# EasyEDA Pro project USB Hub Switch.eprj

# Schematic Schematic 3.0.0

## Sheets
1 Upstream Ports: Board Name: USB Hub Switch V3.0.0; Create Date: 2026-01-22; Page Name: Upstream Ports; Project Name: USB Hub Switch; Schematic Name: Schematic 3.0.0; Update Date: 2026-01-22; Company: EasyEDA.com; Page Size: A4; Version: V1.0
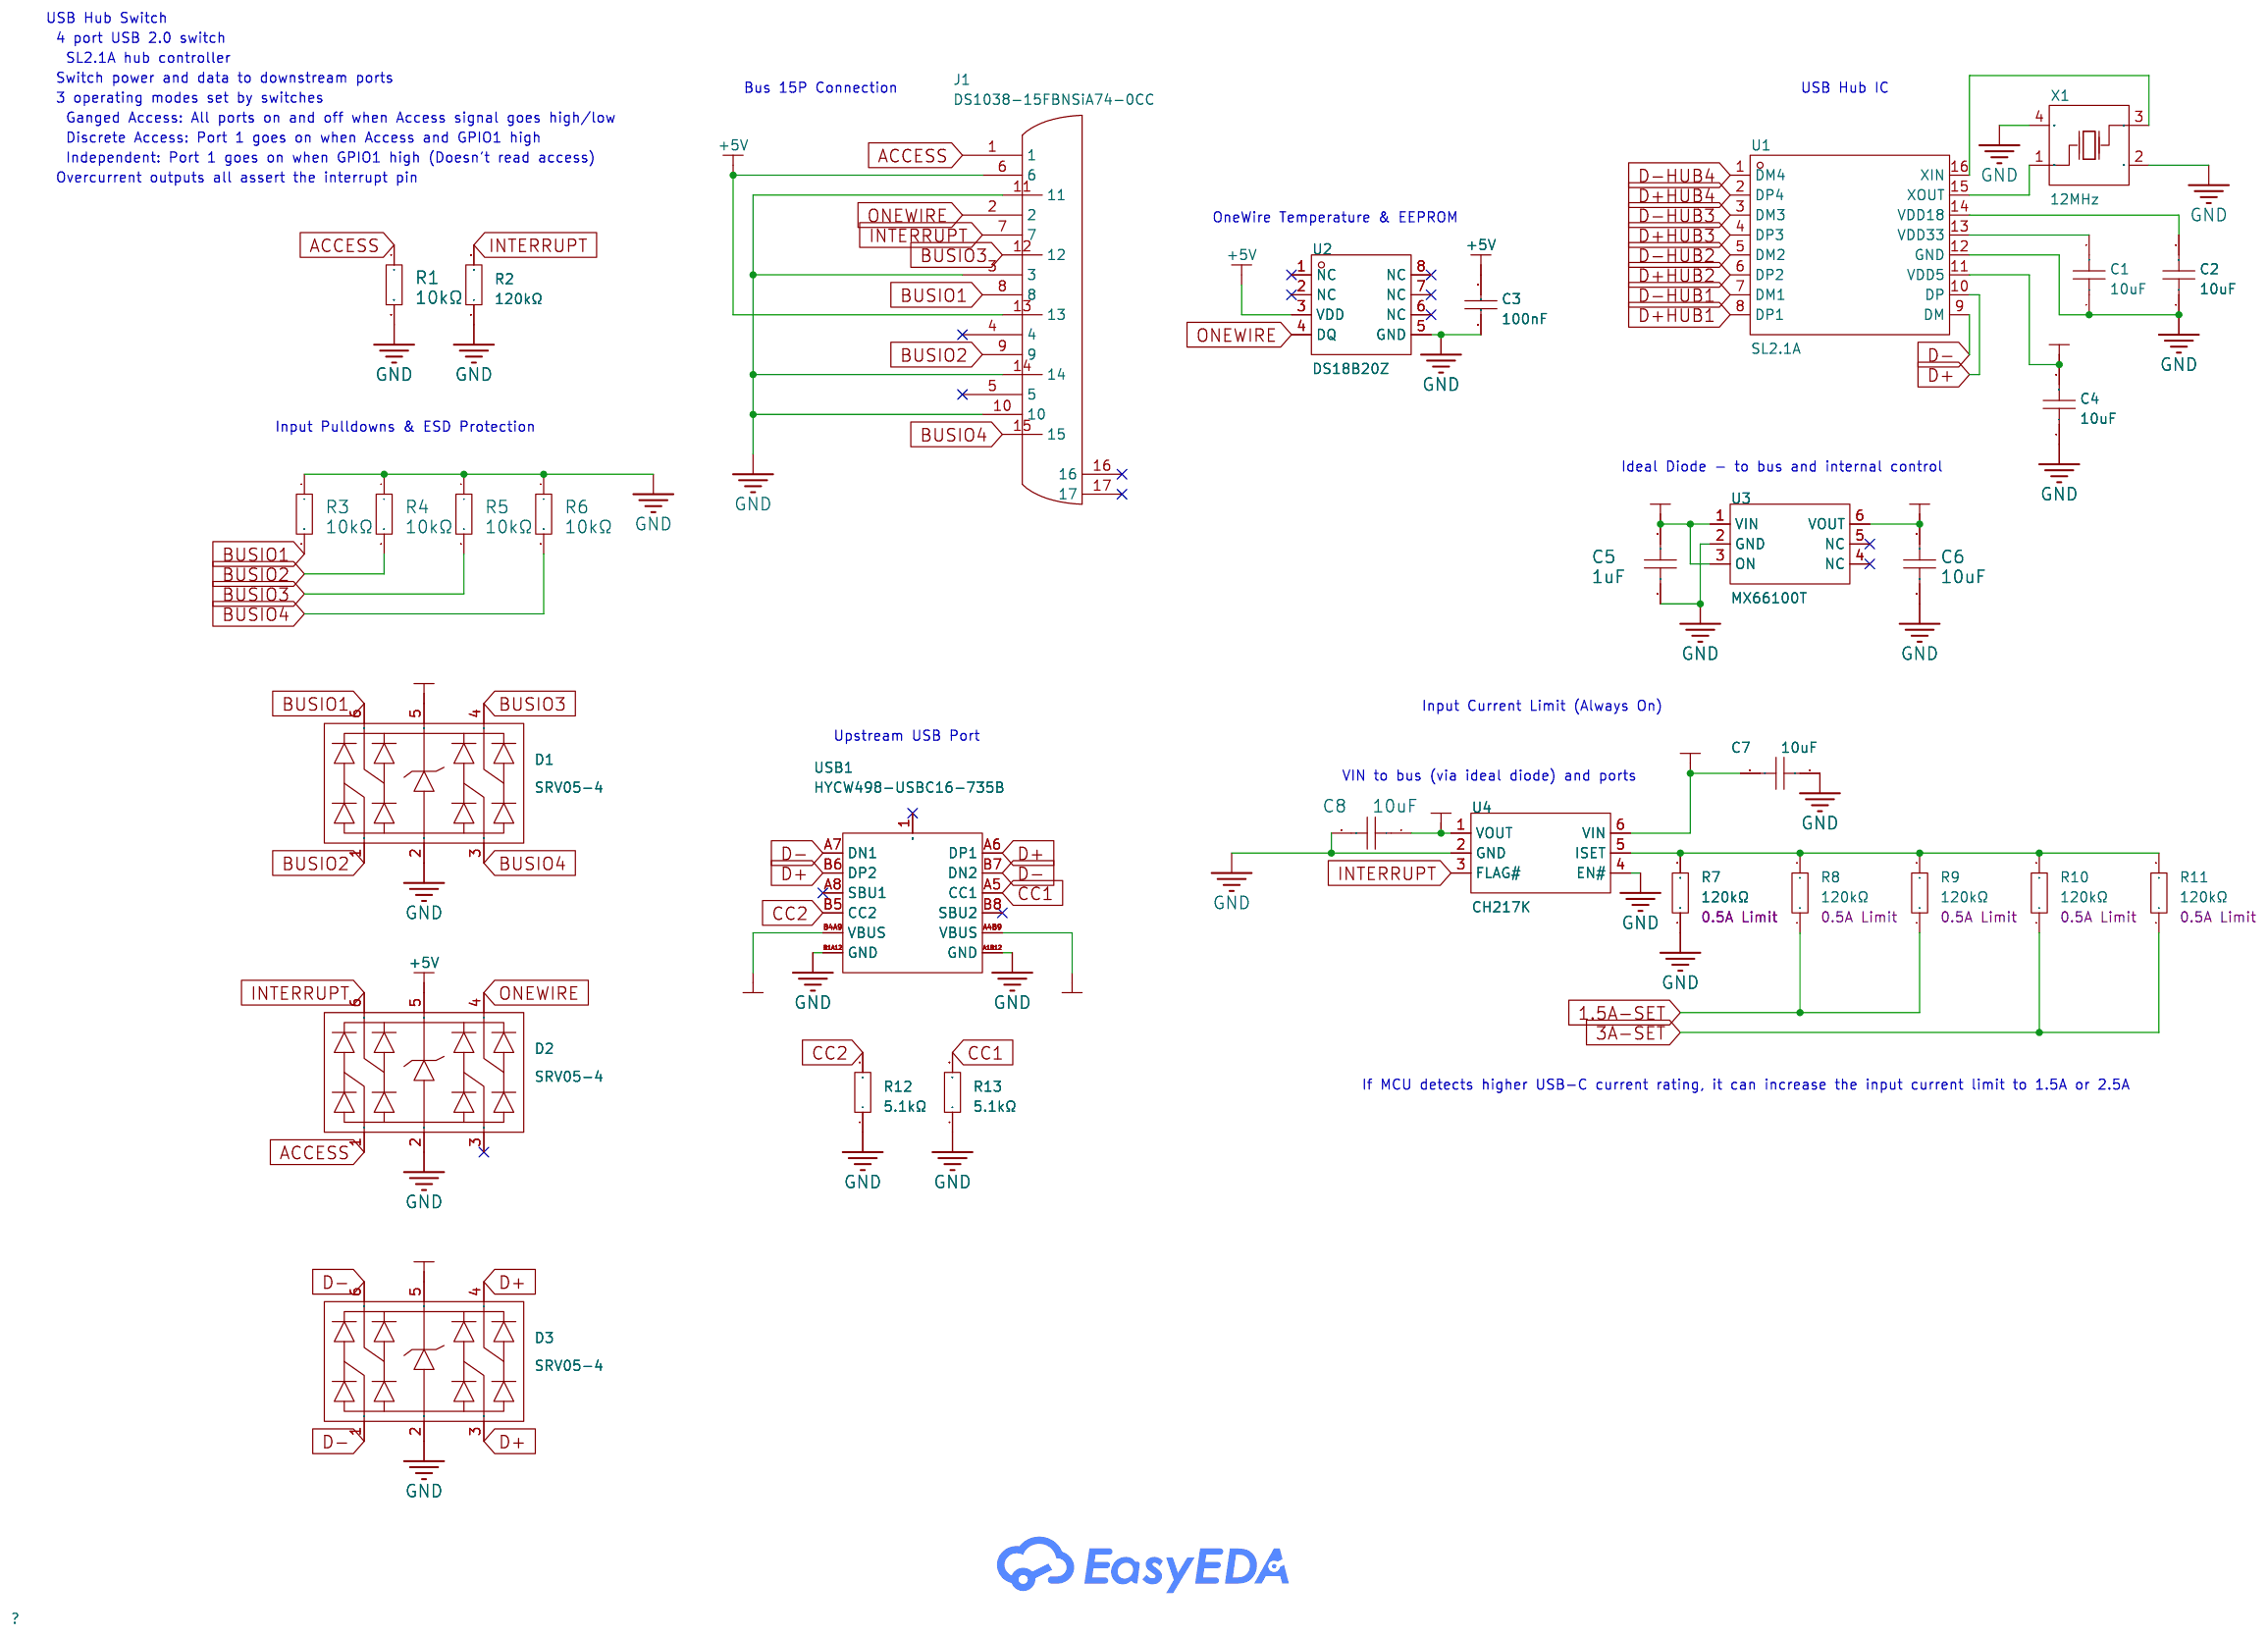
[diagram p0: Upstream Ports]
2 Downstream Ports: Page Name: Downstream Ports
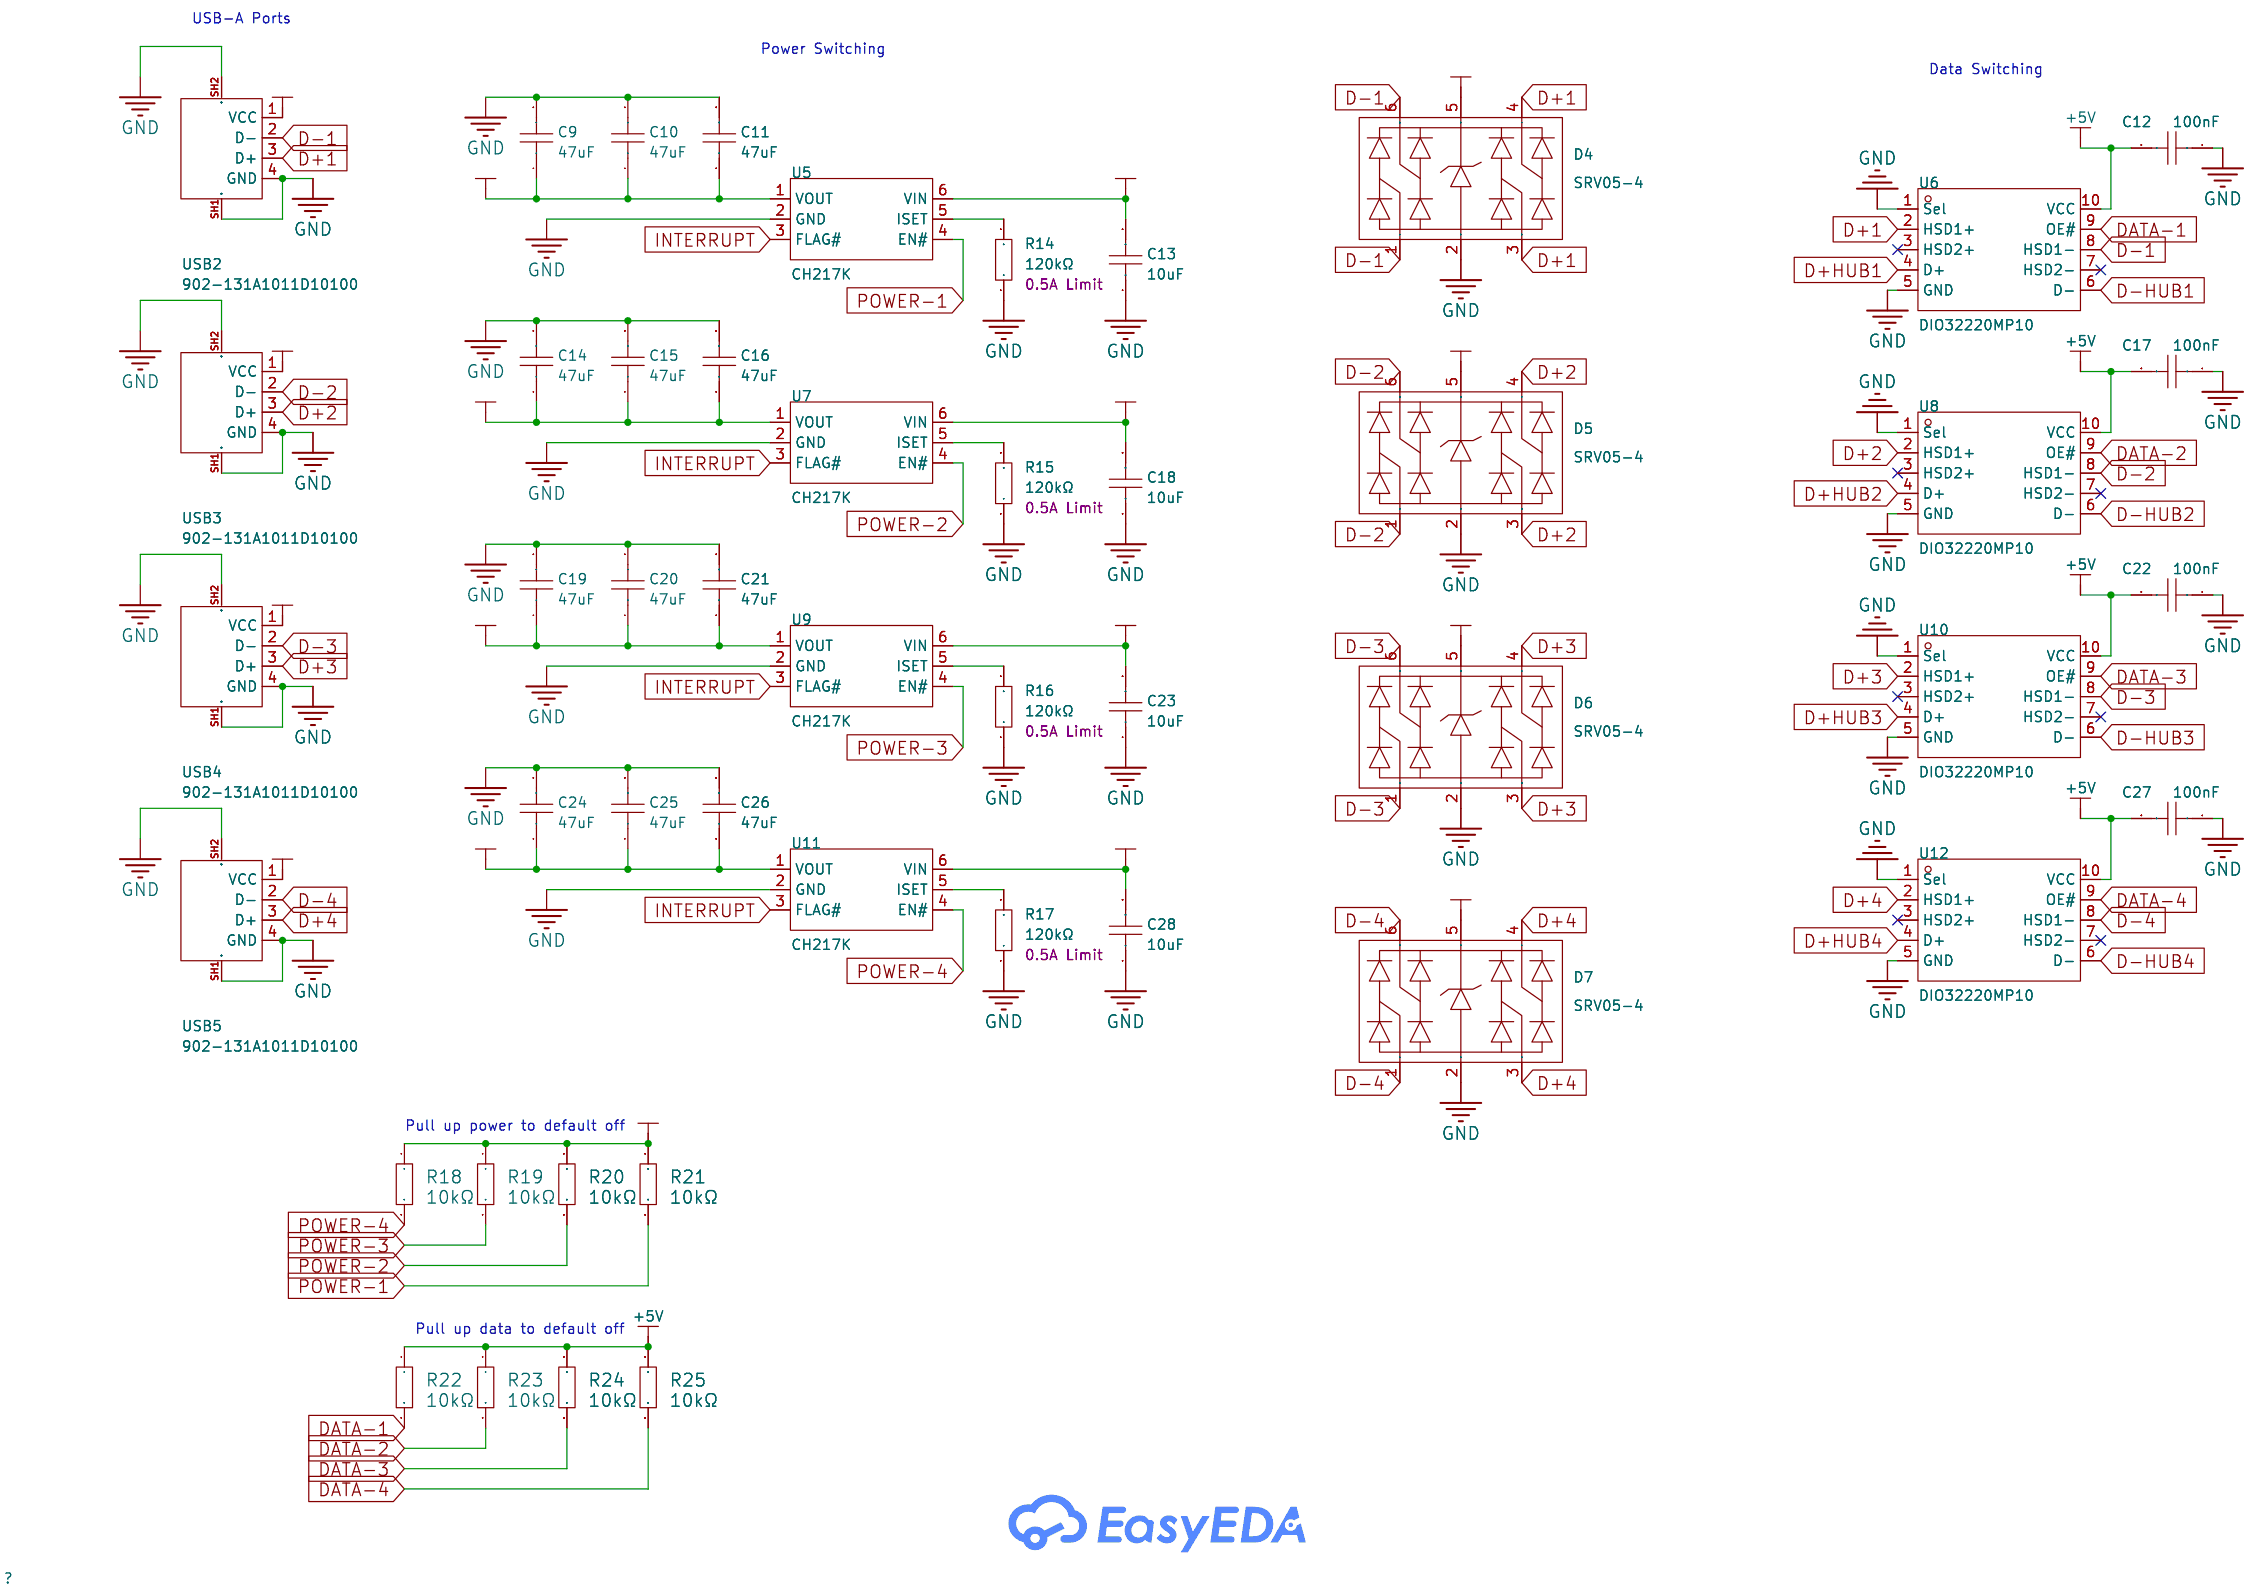
[diagram p1: Downstream Ports]
3 Microcontroller: Page Name: Microcontroller; Update Date: 2026-01-23
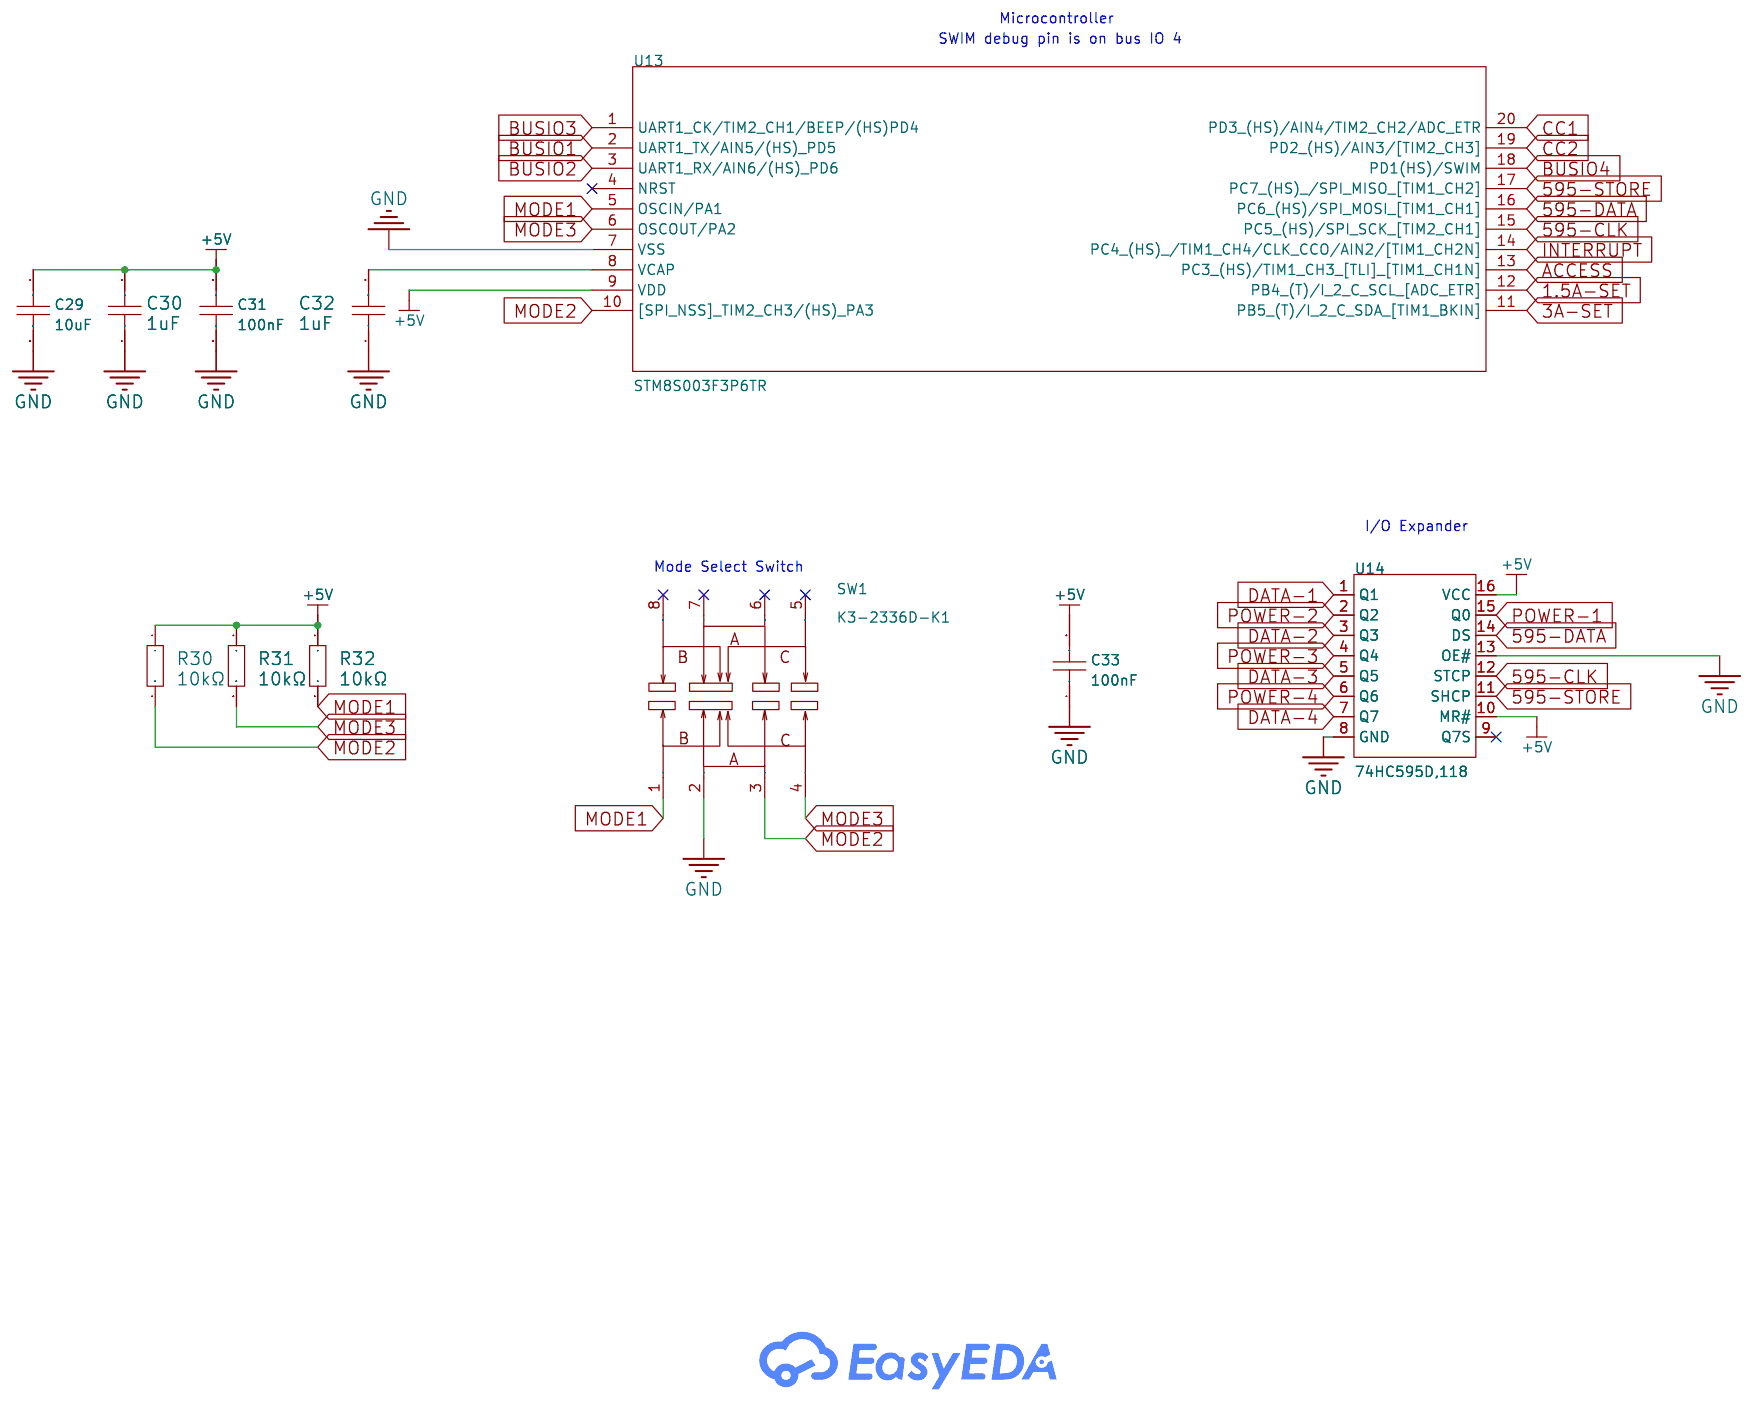
[diagram p2: Microcontroller]
4 Status LEDs: Create Date: 2026-01-23; Page Name: Status LEDs; Update Date: 2026-01-23
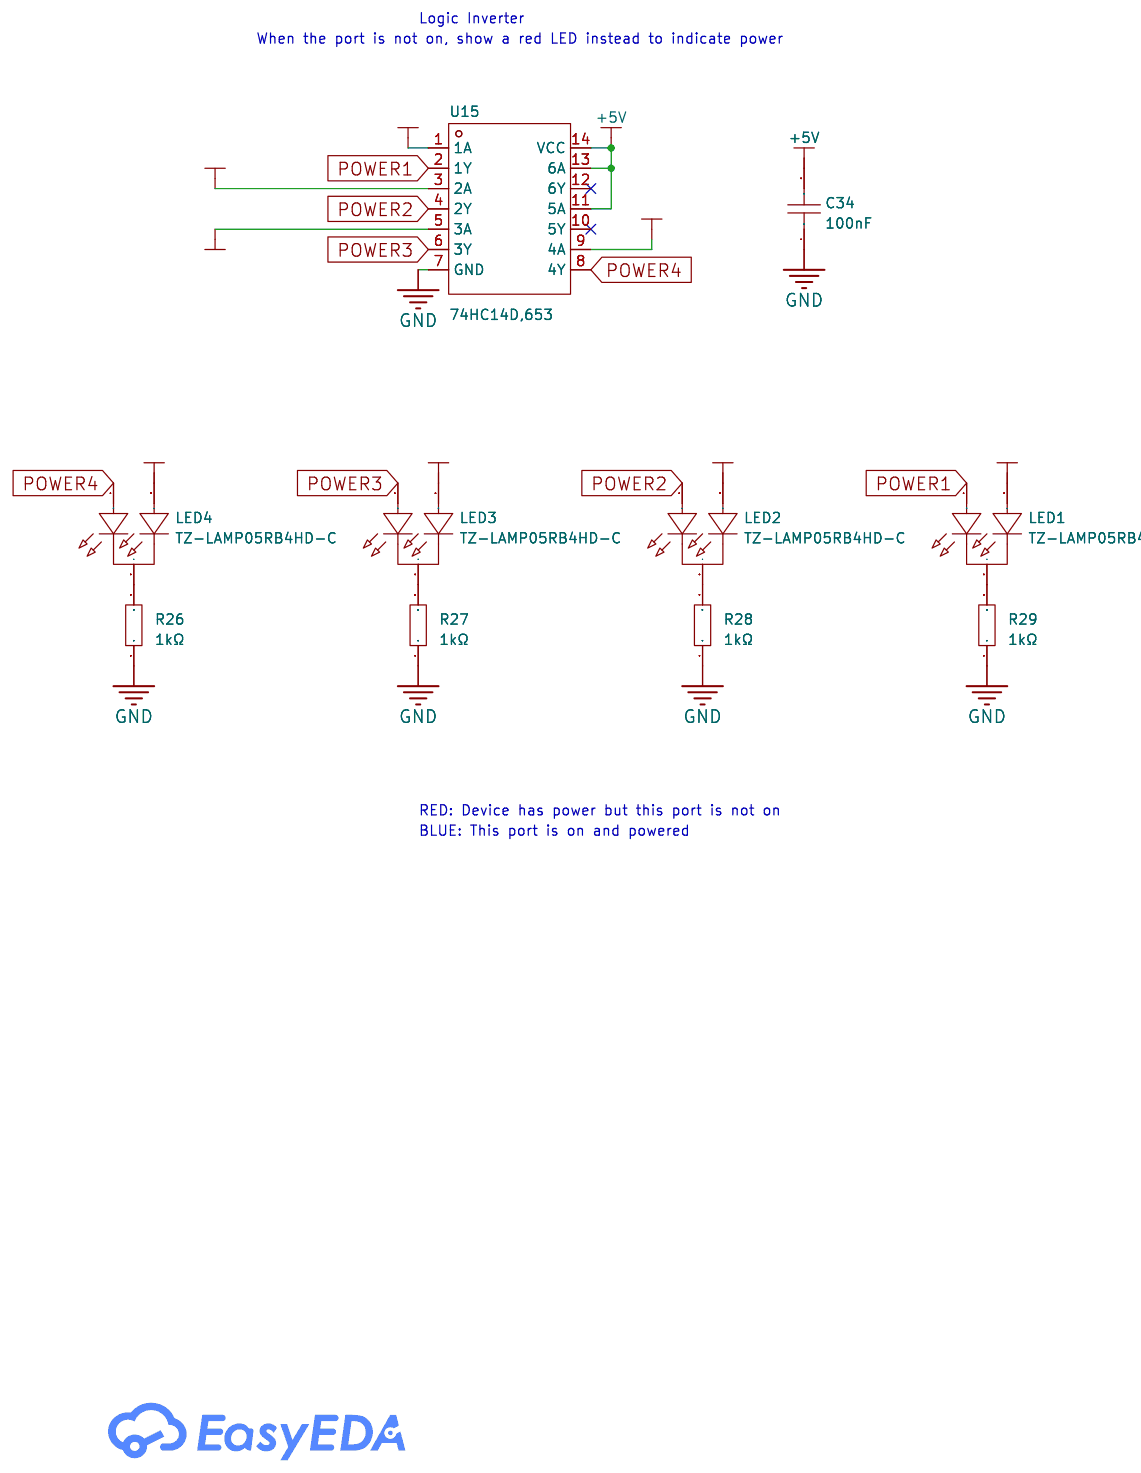
[diagram p3: Status LEDs]

## Parts
sheet Downstream Ports
C9  47uF  [C1206]
C10  47uF  [C1206]
C11  47uF  [C1206]
C12  100nF  [C0603]
C13  10uF  [C0603]
C14  47uF  [C1206]
C15  47uF  [C1206]
C16  47uF  [C1206]
C17  100nF  [C0603]
C18  10uF  [C0603]
C19  47uF  [C1206]
C20  47uF  [C1206]
C21  47uF  [C1206]
C22  100nF  [C0603]
C23  10uF  [C0603]
C24  47uF  [C1206]
C25  47uF  [C1206]
C26  47uF  [C1206]
C27  100nF  [C0603]
C28  10uF  [C0603]
D4  SRV05-4  [SOT-23-6_L2.9-W1.6-P0.95-LS2.8-BL]
D5  SRV05-4  [SOT-23-6_L2.9-W1.6-P0.95-LS2.8-BL]
D6  SRV05-4  [SOT-23-6_L2.9-W1.6-P0.95-LS2.8-BL]
D7  SRV05-4  [SOT-23-6_L2.9-W1.6-P0.95-LS2.8-BL]
R14  120kΩ  [R0603]
R15  120kΩ  [R0603]
R16  120kΩ  [R0603]
R17  120kΩ  [R0603]
R18  10kΩ  [R0603]
R19  10kΩ  [R0603]
R20  10kΩ  [R0603]
R21  10kΩ  [R0603]
R22  10kΩ  [R0603]
R23  10kΩ  [R0603]
R24  10kΩ  [R0603]
R25  10kΩ  [R0603]
U5  CH217K  [SOT-23-6_L2.9-W1.6-P0.95-LS2.8-BL]
U6  DIO32220MP10  [MSOP-10_L3.0-W3.0-P0.50-LS5.0-BL]
U7  CH217K  [SOT-23-6_L2.9-W1.6-P0.95-LS2.8-BL]
U8  DIO32220MP10  [MSOP-10_L3.0-W3.0-P0.50-LS5.0-BL]
U9  CH217K  [SOT-23-6_L2.9-W1.6-P0.95-LS2.8-BL]
U10  DIO32220MP10  [MSOP-10_L3.0-W3.0-P0.50-LS5.0-BL]
U11  CH217K  [SOT-23-6_L2.9-W1.6-P0.95-LS2.8-BL]
U12  DIO32220MP10  [MSOP-10_L3.0-W3.0-P0.50-LS5.0-BL]
USB2  902-131A1011D10100  [USB-A-TH__USB-AF-90]
USB3  902-131A1011D10100  [USB-A-TH__USB-AF-90]
USB4  902-131A1011D10100  [USB-A-TH__USB-AF-90]
USB5  902-131A1011D10100  [USB-A-TH__USB-AF-90]
sheet Microcontroller
C29  10uF  [C0603]
C30  1uF  [C0603]
C31  100nF  [C0603]
C32  1uF  [C0603]
C33  100nF  [C0603]
R30  10kΩ  [R0603]
R31  10kΩ  [R0603]
R32  10kΩ  [R0603]
SW1  K3-2336D-K1  [SW-TH_K3-2336D-K1]
U13  STM8S003F3P6TR  [TSSOP-20_L6.5-W4.4-P0.65-LS6.4-BL]
U14  74HC595D,118  [SOIC-16_L9.9-W3.9-P1.27-LS6.0-BL]
sheet Status LEDs
C34  100nF  [C0603]
LED1  TZ-LAMP05RB4HD-C  [LED-TH_3P-BD5.8-P2.54-R-BI]
LED2  TZ-LAMP05RB4HD-C  [LED-TH_3P-BD5.8-P2.54-R-BI]
LED3  TZ-LAMP05RB4HD-C  [LED-TH_3P-BD5.8-P2.54-R-BI]
LED4  TZ-LAMP05RB4HD-C  [LED-TH_3P-BD5.8-P2.54-R-BI]
R26  1kΩ  [R0805]
R27  1kΩ  [R0805]
R28  1kΩ  [R0805]
R29  1kΩ  [R0805]
U15  74HC14D,653  [SOIC-14_L8.7-W3.9-P1.27-LS6.0-BL]
sheet Upstream Ports
C1  10uF  [C0603]
C2  10uF  [C0603]
C3  100nF  [C0805]
C4  10uF  [C0603]
C5  1uF  [C0603]
C6  10uF  [C0603]
C7  10uF  [C0603]
C8  10uF  [C0603]
D1  SRV05-4  [SOT-23-6_L2.9-W1.6-P0.95-LS2.8-BL]
D2  SRV05-4  [SOT-23-6_L2.9-W1.6-P0.95-LS2.8-BL]
D3  SRV05-4  [SOT-23-6_L2.9-W1.6-P0.95-LS2.8-BL]
J1  DS1038-15FBNSiA74-0CC  [DSUB-TH_DS1038-15FBNSIA74-0CC]  (no BOM)
R1  10kΩ  [R0603]
R2  120kΩ  [R0603]
R3  10kΩ  [R0603]
R4  10kΩ  [R0603]
R5  10kΩ  [R0603]
R6  10kΩ  [R0603]
R7  120kΩ  [R0603]
R8  120kΩ  [R0603]
R9  120kΩ  [R0603]
R10  120kΩ  [R0603]
R11  120kΩ  [R0603]
R12  5.1kΩ  [R0603]
R13  5.1kΩ  [R0603]
U1  SL2.1A  [SOP-16_L10.0-W3.9-P1.27-LS6.0-BL]
U2  DS18B20Z  [SOP-8_L4.9-W3.9-P1.27-LS6.0-BL]
U3  MX66100T  [SOT-23-6_L2.9-W1.6-P0.95-LS2.9-BL]
U4  CH217K  [SOT-23-6_L2.9-W1.6-P0.95-LS2.8-BL]
USB1  HYCW498-USBC16-735B  [USB-C-SMD_HYCW498-USBC16-735B]
X1  12MHz  [OSC-SMD_4P-L3.2-W2.5-BL]

## Library data of the parts
C9-C11 C14-C16 C19-C21 C24-C26 = CL31A476MPHNNNE: LCSC Part Name: 47uF ±20% 10V; Supplier Part: C96123; Manufacturer: SAMSUNG(三星); Supplier Footprint: 1206; Datasheet: https://item.szlcsc.com/datasheet/CL31A476MPHNNNE/97327.html; Supplier: LCSC; Tolerance: ±20%; Voltage Rating: 10V; Temperature Coefficient: X5R
C12 C17 C22 C27 C31 C33 C34 = CC0603KRX7R9BB104: LCSC Part Name: 100nF ±10% 50V; Supplier Part: C14663; Manufacturer: YAGEO(国巨); Supplier Footprint: 0603; JLCPCB Part Class: Basic Part; Datasheet: https://item.szlcsc.com/datasheet/CC0603KRX7R9BB104/15331.html; Supplier: LCSC; Tolerance: ±10%; Voltage Rating: 50V; Temperature Coefficient: X7R
C1 C2 C4 C7 C13 C18 C23 C28 C29 = CL10A106MA8NRNC: Capacitance: Tolerance:±20% Tolerance:±20% Voltage Rated: Temperature Coefficient:; LCSC Part Name: 10uF ±20% 25V; Supplier Part: C96446; Manufacturer: SAMSUNG(三星); Supplier Footprint: 0603; Datasheet: https://atta.szlcsc.com/upload/public/pdf/source/20170325/1490427913016.pdf; Supplier: LCSC; Tolerance: ±20%
D1-D7 = SRV05-4_C558418: polarity:Unidirectional Reverse Stand-Off Voltage (Vrwm):5V Maximum Clamping Voltage:20V Peak Pulse Current (Ipp):3A Peak Pulse Power Dissipation (Ppp):60W Breakdown Voltage:6V Reverse Leakage Current (Ir):500nA Number of Lines:Four channels Operating Tem; LCSC Part Name: ESD，可防25kV静电; Supplier Part: C558418; Manufacturer: TECH PUBLIC(台舟); Supplier Footprint: SOT-23-6; JLCPCB Part Class: Extended Part; Datasheet: https://atta.szlcsc.com/upload/public/pdf/source/20230615/CFFDFFE99FDA0E92DF9600783B3A2A20.pdf; Supplier: LCSC; polarity: Unidirectional; Reverse Stand-Off Voltage (Vrwm): 5V; Maximum Clamping Voltage: 20V; Peak Pulse Current (Ipp): 3A; Peak Pulse Power Dissipation (Ppp): 60W; Breakdown Voltage: 6V; Reverse Leakage Current (Ir): 500nA; Number of Lines: Four channels; Operating Temperature: -55℃~+125℃; level of protection: IEC 61000-4-2; Type: ESD
R2 R7-R11 R14-R17 = 0603WAF1203T5E: LCSC Part Name: 120kΩ ±1% 100mW 厚膜电阻; Supplier Part: C25808; Manufacturer: UNI-ROYAL(厚声); Supplier Footprint: 0603; Datasheet: https://item.szlcsc.com/datasheet/0603WAF1203T5E/26551.html; Supplier: LCSC; Type: Thick Film Resistor; Tolerance: ±1%; Power(Watts): 100mW; Voltage-Supply(Max): 75V; Temperature Coefficient: ±100ppm/℃; Operating Temperature: -55℃~+155℃; Note: 0.5A Limit
R1 R3-R6 R18-R25 R30-R32 = 0603WAF1002T5E: Type:Thick Film Resistors Resistance:10kΩ Tolerance:±1% Tolerance:±1% Power(Watts): Overload Voltage (Max): Temperature Coefficient:±100ppm/℃ Temperature Coefficient:±100ppm/℃ Operating Temperature Range:-55℃~+155℃ Operating Temperature Range:-55℃~+155℃; LCSC Part Name: 厚膜电阻 10kΩ ±1% 100mW; Supplier Part: C25804; Manufacturer: UNI-ROYAL(厚声); Supplier Footprint: 0603; JLCPCB Part Class: Basic Part; Datasheet: https://atta.szlcsc.com/upload/public/pdf/source/20200306/C422600_1E6D84923E4A46A82E41ADD87F860B5C.pdf; Supplier: LCSC; Type: Thick Film Resistors; Tolerance: ±1%; Temperature Coefficient: ±100ppm/℃; Operating Temperature Range: -55℃~+155℃
U4 U5 U7 U9 U11 = CH217K: LCSC Part Name: USB 限流配电开关芯片; Supplier Part: C7462749; Manufacturer: WCH(南京沁恒); Supplier Footprint: SOT-23-6; JLCPCB Part Class: Extended Part; Datasheet: https://item.szlcsc.com/datasheet/CH217K/8495424.html; Supplier: LCSC; Type: Load Switch; Number of Channels: 1; Control Input Logic: Active Low; Output Current: 2.7A; Voltage - Supply: 2.7V~5.5V; RDS(on): 70mΩ; Operating Temperature	-: -40℃~+85℃
U6 U8 U10 U12 = DIO32220MP10: LCSC Part Name: 低功耗，USB2.0高速开关; Supplier Part: C444624; Manufacturer: DIOO(帝奥微); Supplier Footprint: MSOP-10; Datasheet: https://item.szlcsc.com/datasheet/DIO32220MP10/445952.html; Supplier: LCSC; USB Protocol: USB 2.0; Voltage - Supply: 2.7V~5.5V; Data Rate: 480Mbps; Operating Temperature: -40℃~+85℃
USB2-USB5 = 902-131A1011D10100: LCSC Part Name: Type-A 母; Supplier Part: C2345; Manufacturer: 精拓金; Supplier Footprint: 插件; JLCPCB Part Class: Extended Part; Datasheet: https://item.szlcsc.com/datasheet/902-131A1011D10100/2721.html; Supplier: LCSC; Connector Type: Type-A; Protocol Standard: USB 2.0; Gender: Female; Number of Contacts: 4P; Number of Ports: 1; Current Rating-Power: 1.5A; Voltage Rating: 30V; Connect-Disconnect Life: 1500 Cycles; Length: 14.1mm; Detection color: White
C5 C30 C32 = CL10A105KB8NNNC: Capacitance: Tolerance:±10% Tolerance:±10% Voltage Rated: Temperature Coefficient:; LCSC Part Name: 1uF ±10% 50V; Supplier Part: C15849; Manufacturer: SAMSUNG(三星); Supplier Footprint: 0603; JLCPCB Part Class: Basic Part; Datasheet: https://atta.szlcsc.com/upload/public/pdf/source/20160218/1457707763339.pdf; Supplier: LCSC; Tolerance: ±10%
SW1 = K3-2336D-K1: LCSC Part Name: 直插三档 滑动开关; Supplier Part: C223867; Manufacturer: 韩国韩荣; Supplier Footprint: 插件,13x3.5mm; Datasheet: https://item.szlcsc.com/datasheet/K3-2336D-K1/224012.html; Supplier: LCSC; Circuit: DP3T; Actuator Style: Rectangular Columnar; Termination Style: PC Pin; Length: 13mm; Width: 3.5mm; Switch Height: 3.5mm; Mounting Type: Through Hole; Actuator Color: Black; Current Rating: 300mA; Voltage Rating: 6V; Life: 10,000 Cycles; Operating Temperature: -25℃~+80℃
U13 = STM8S003F3P6TR: LCSC Part Name: 主流超值系列8位MCU，具有8 KB Flash、16 MHz CPU和集成EEPROM; Supplier Part: C52717; Manufacturer: ST(意法半导体); Supplier Footprint: TSSOP-20; JLCPCB Part Class: Extended Part; Datasheet: https://item.szlcsc.com/datasheet/STM8S003F3P6TR/53732.html; Supplier: LCSC; CPU Core: STM8; CPU Maximum Speed: 16MHz; Program Storage Size: 8KB; Program Memory Type: FLASH; EEPROM: 128Byte; Number of I/O: 16; ADC (Bit): 10bit; Voltage - Supply: 2.95V~5.5V
U14 = 74HC595D,118: LCSC Part Name: 三态输出 串行至串行或并行移位寄存器; Supplier Part: C5947; Manufacturer: Nexperia(安世); Supplier Footprint: SOIC-16; JLCPCB Part Class: Basic Part; Datasheet: https://item.szlcsc.com/datasheet/74HC595D%252C118/6413.html; Supplier: LCSC; Function: Serial-to-Serial or Parallel; Voltage - Supply: 2V~6V; Clock Frequency: 100MHz; Number of Elements: 1; Number of Bits per Element: 8; Output Type: Tri-State; Series: 74HC; Operating Temperature: -40℃~+125℃; Propagation Delay: 19ns@4.5V,50pF
LED1-LED4 = TZ-LAMP05RB4HD-C: LCSC Part Name: 红灯,蓝灯; Supplier Part: C779425; Manufacturer: TUOZHAN(拓展光电); Supplier Footprint: 插件,D=5mm; Datasheet: https://item.szlcsc.com/datasheet/TZ-LAMP05RB4HD-C/829086.html; Supplier: LCSC; Lamp Holder Type: 5 mm round LED; Illumination Color: Red, Blue; Voltage - Forward(Vf): 1.9V~2.4V；2.8V~3.4V; Power(Watts): 90mW；60mW; Forward Current: 20mA; Wavelength - Dominant: 465nm~470nm；620nm~625nm; Diode Configuration: Common Cathode; Luminous Intensity: 200mcd；300mcd; Viewing Angle: 60°; Operating Temperature: -40℃~+80℃
R26-R29 = 0805W8F1001T5E: Type:Thick Film Resistors Resistance:1kΩ Tolerance:±1% Tolerance:±1% Power(Watts): Overload Voltage (Max): Temperature Coefficient:±100ppm/℃ Temperature Coefficient:±100ppm/℃ Operating Temperature Range:-55℃~+155℃ Operating Temperature Range:-55℃~+155℃; LCSC Part Name: 1kΩ ±1% 125mW 厚膜电阻; Supplier Part: C17513; Manufacturer: UNI-ROYAL(厚声); Supplier Footprint: 0805; Datasheet: https://atta.szlcsc.com/upload/public/pdf/source/20200306/C422600_1E6D84923E4A46A82E41ADD87F860B5C.pdf; Supplier: LCSC; Type: Thick Film Resistors; Tolerance: ±1%; Temperature Coefficient: ±100ppm/℃; Operating Temperature Range: -55℃~+155℃
U15 = 74HC14D,653: LCSC Part Name: 六路施密特触发反相器; Supplier Part: C5605; Manufacturer: Nexperia(安世); Supplier Footprint: SOIC-14; JLCPCB Part Class: Basic Part; Datasheet: https://atta.szlcsc.com/upload/public/pdf/source/20240724/EDEB5B2454CA09835E17810C4B06A75D.pdf; Supplier: LCSC; Input Type: Schmitt Trigger; Supply Voltage(Single): 2V~6V; Supply Current (Max): 2uA; Number of Circuits: 6; Number of Inputs: 1; Sink Current: 5.2mA; Source Current: 5.2mA; High level range (VIH): 1.5V~4.2V; Low level range (VIL): 300mV~1.2V; Max Propagation Delay: 21ns@6V,50pF; Series: 74HCSeries; Operating Temperature: -40℃~+125℃
C3 = CL21B104KCFNNNE: Capacitance:100nF Tolerance:±10% Tolerance:±10% Voltage Rating:100V Temperature Coefficient:X7R; LCSC Part Name: 100nF ±10% 100V; Supplier Part: C28233; Manufacturer: SAMSUNG(三星); Supplier Footprint: 0805; JLCPCB Part Class: Basic Part; Datasheet: https://item.szlcsc.com/datasheet/CL21B104KCFNNNE/28983.html; Supplier: LCSC; Tolerance: ±10%; Voltage Rating: 100V; Temperature Coefficient: X7R
C6 C8 = CL10A106MA8NRNC: Capacitance:10uF Tolerance:±20% Tolerance:±20% Voltage Rating:25V Temperature Coefficient:X5R; LCSC Part Name: 10uF ±20% 25V; Supplier Part: C96446; Manufacturer: SAMSUNG(三星); Supplier Footprint: 0603; JLCPCB Part Class: Basic Part; Datasheet: https://item.szlcsc.com/datasheet/CL10A106MA8NRNC/97651.html; Supplier: LCSC; Tolerance: ±20%; Voltage Rating: 25V; Temperature Coefficient: X5R
J1 = DS1038-15FBNSiA74-0CC: Connector Type:High Density D-Sub Gender:Female Number of Pins:15P Mounting Type:Right Angle Number of Rows:3 Current Rating-Signal:3A Current Rating-Power:- Voltage Rating:- Color:Black Operating Temperature:-40℃~+105℃ Operating Temperature:-40℃~+105℃; LCSC Part Name: 黑色 1000/盒 D-Sub 母 P数:15P; Supplier Part: C75754; Manufacturer: CONNFLY; Supplier Footprint: 弯插; JLCPCB Part Class: Extended Part; Datasheet: https://item.szlcsc.com/datasheet/DS1038-15FBNSiA74-0CC/76880.html; Supplier: LCSC; Connector Type: High Density D-Sub; Gender: Female; Number of Pins: 15P; Mounting Type: Right Angle; Number of Rows: 3; Current Rating-Signal: 3A; Color: Black; Operating Temperature: -40℃~+105℃
R12 R13 = 0603WAF5101T5E: LCSC Part Name: 5.1kΩ ±1% 100mW 厚膜电阻; Supplier Part: C23186; Manufacturer: UNI-ROYAL(厚声); Supplier Footprint: 0603; Datasheet: https://item.szlcsc.com/datasheet/0603WAF5101T5E/23913.html; Supplier: LCSC; Type: Thick Film Resistor; Tolerance: ±1%; Power(Watts): 100mW; Voltage-Supply(Max): 75V; Temperature Coefficient: ±100ppm/℃; Operating Temperature: -55℃~+155℃
U1 = SL2.1A: Applications Function: Protocol:; Supplier Part: C192893; Manufacturer: CoreChips(和芯润德); Supplier Footprint: SOP-16; JLCPCB Part Class: Extended Part; Datasheet: https://atta.szlcsc.com/upload/public/pdf/source/20180522/C192893_624110D24898D57AAC785E3DF98EA862.pdf; Supplier: LCSC
U2 = DS18B20Z: Resolution:±0.4℃ Resolution:±0.4℃ Supply Voltage:2.5V~5.5V Supply Voltage:2.5V~5.5V; LCSC Part Name: 温度传感器; Supplier Part: C695837; Manufacturer: UMW(友台半导体); Supplier Footprint: SOIC-8; JLCPCB Part Class: Extended Part; Datasheet: https://atta.szlcsc.com/upload/public/pdf/source/20231109/DC3DA9D47D486EF40A6E0F08B9A498E3.pdf; Supplier: LCSC; Resolution: ±0.4℃; Supply Voltage: 2.5V~5.5V
U3 = MX66100T: LCSC Part Name: 1V to 5.5V、2A、100mΩ理想二极管; Supplier Part: C53121238; Manufacturer: Wuxi Maxinmicro(无锡明芯微); Supplier Footprint: SOT23-6; JLCPCB Part Class: Extended Part; Datasheet: https://item.szlcsc.com/datasheet/MX66100T/56102987.html; Supplier: LCSC
USB1 = HYCW498-USBC16-735B: LCSC Part Name: Type-C 母 卧贴; Supplier Part: C42400252; Manufacturer: 华宇创; Supplier Footprint: SMD; JLCPCB Part Class: Extended Part; Datasheet: https://item.szlcsc.com/datasheet/HYCW498-USBC16-735B/44352785.html; Supplier: LCSC; Connector Type: Type-C; Gender: Female; Mounting Type: Surface Mount, Right Angle; Number of Contacts: 16P; Number of Ports: 1; Current Rating-Power: 3A; Connect-Disconnect Life: 10,000 Cycles; Length: 7.35mm; Detection color: Black; Operating Temperature: -30℃~+85℃
X1 = X322512MSB4SI: Crystal Type:SMD Crystal Resonator Frequency: Frequency Tolerance:±10ppm Frequency Tolerance:±10ppm Frequency Stability:±30ppm Frequency Stability:±30ppm Load Capacitance: Operating Temperature: Operating Temperature:; LCSC Part Name: 12MHz ±10ppm 20pF; Supplier Part: C9002; Manufacturer: YXC(扬兴晶振); Supplier Footprint: SMD3225-4P; JLCPCB Part Class: Basic Part; Datasheet: https://atta.szlcsc.com/upload/public/pdf/source/20210329/C112971_1F611BDC486E193C1706F6D8EB5AA189.pdf; Supplier: LCSC; Crystal Type: SMD Crystal Resonator; Frequency Tolerance: ±10ppm; Frequency Stability: ±30ppm

## Nets
+5V: C3.2 C6.2 C12.2 C17.2 C22.2 C27.2 C29.1 C30.2 C31.2 C33.2 C34.2 D1.5 D2.5 J1.6 J1.13 R22.1 R23.1 R24.1 R25.1 R30.1 R31.1 R32.1 U2.3(VDD) U3.6(VOUT) U6.10(VCC) U8.10(VCC) U10.10(VCC) U12.10(VCC) U13.9(VDD) U14.10(MR#) U14.16(VCC) U15.11(5A) U15.13(6A) U15.14(VCC)
GND: C1.1 C2.1 C3.1 C4.1 C5.1 C6.1 C7.1 C8.2 C9.2 C10.2 C11.2 C12.1 C13.1 C14.2 C15.2 C16.2 C17.1 C18.1 C19.2 C20.2 C21.2 C22.1 C23.1 C24.2 C25.2 C26.2 C27.1 C28.1 C29.2 C30.1 C31.1 C32.1 C33.1 C34.1 D1.2 D2.2 D3.2 D4.2 D5.2 D6.2 D7.2 J1.3 J1.10 J1.11 J1.14 R1.2 R2.1 R3.1 R4.1 R5.1 R6.1 R7.1 R12.1 R13.1 R14.1 R15.1 R16.1 R17.1 R26.1 R27.1 R28.1 R29.1 SW1.2 U1.12(GND) U2.5(GND) U3.2(GND) U4.2(GND) U4.4(EN#) U5.2(GND) U6.1(Sel) U6.5(GND) U7.2(GND) U8.1(Sel) U8.5(GND) U9.2(GND) U10.1(Sel) U10.5(GND) U11.2(GND) U12.1(Sel) U12.5(GND) U13.7(VSS) U14.8(GND) U14.13(OE#) U15.7(GND) USB1.A1B12(GND) USB1.B1A12(GND) USB2.4(GND) USB2.SH1 USB2.SH2 USB3.4(GND) USB3.SH1 USB3.SH2 USB4.4(GND) USB4.SH1 USB4.SH2 USB5.4(GND) USB5.SH1 USB5.SH2 X1.2(GND) X1.4(GND)
VIN: C4.2 C5.2 C8.1 C13.2 C18.2 C23.2 C28.2 R18.1 R19.1 R20.1 R21.1 U1.11(VDD5) U3.1(VIN) U3.3(ON) U4.1(VOUT) U5.6(VIN) U7.6(VIN) U9.6(VIN) U11.6(VIN)
1.5A-SET: R8.1 R9.1 U13.12(PB4 (T)/I 2 C_SCL [ADC_ETR])
3A-SET: R10.1 R11.1 U13.11(PB5 (T)/I 2 C_SDA [TIM1_BKIN])
595-CLK: U13.15(PC5 (HS)/SPI_SCK [TIM2_CH1]) U14.12(STCP)
595-DATA: U13.16(PC6 (HS)/SPI_MOSI [TIM1_CH1]) U14.14(DS)
595-STORE: U13.17(PC7 (HS) /SPI_MISO [TIM1_CH2]) U14.11(SHCP)
ACCESS: D2.1 J1.1 R1.1 U13.13(PC3 (HS)/TIM1_CH3 [TLI] [TIM1_CH1N])
BUSIO1: D1.6 J1.8 R3.2 U13.2(UART1_TX/AIN5/(HS) PD5)
BUSIO2: D1.1 J1.9 R4.2 U13.3(UART1_RX/AIN6/(HS) PD6)
BUSIO3: D1.4 J1.12 R5.2 U13.1(UART1_CK/TIM2_CH1/BEEP/(HS)PD4)
BUSIO4: D1.3 J1.15 R6.2 U13.18(PD1(HS)/SWIM)
CC1: R13.2 U13.20(PD3 (HS)/AIN4/TIM2_CH2/ADC_ETR) USB1.A5(CC1)
CC2: R12.2 U13.19(PD2 (HS)/AIN3/[TIM2_CH3]) USB1.B5(CC2)
D+: D3.3 D3.4 U1.10(DP) USB1.A6(DP1) USB1.B6(DP2)
D+1: D4.3 D4.4 U6.2(HSD1+) USB2.3(D+)
D+2: D5.3 D5.4 U8.2(HSD1+) USB3.3(D+)
D+3: D6.3 D6.4 U10.2(HSD1+) USB4.3(D+)
D+4: D7.3 D7.4 U12.2(HSD1+) USB5.3(D+)
D+HUB1: U1.8(DP1) U6.4(D+)
D+HUB2: U1.6(DP2) U8.4(D+)
D+HUB3: U1.4(DP3) U10.4(D+)
D+HUB4: U1.2(DP4) U12.4(D+)
D-: D3.1 D3.6 U1.9(DM) USB1.A7(DN1) USB1.B7(DN2)
D-1: D4.1 D4.6 U6.8(HSD1-) USB2.2(D-)
D-2: D5.1 D5.6 U8.8(HSD1-) USB3.2(D-)
D-3: D6.1 D6.6 U10.8(HSD1-) USB4.2(D-)
D-4: D7.1 D7.6 U12.8(HSD1-) USB5.2(D-)
D-HUB1: U1.7(DM1) U6.6(D-)
D-HUB2: U1.5(DM2) U8.6(D-)
D-HUB3: U1.3(DM3) U10.6(D-)
D-HUB4: U1.1(DM4) U12.6(D-)
DATA-1: R22.2 U6.9(OE#) U14.1(Q1)
DATA-2: R23.2 U8.9(OE#) U14.3(Q3)
DATA-3: R24.2 U10.9(OE#) U14.5(Q5)
DATA-4: R25.2 U12.9(OE#) U14.7(Q7)
INTERRUPT: D2.6 J1.7 R2.2 U4.3(FLAG#) U5.3(FLAG#) U7.3(FLAG#) U9.3(FLAG#) U11.3(FLAG#) U13.14(PC4 (HS) /TIM1_CH4/CLK_CCO/AIN2/[TIM1_CH2N])
MODE1: R32.2 SW1.1 U13.5(OSCIN/PA1)
MODE2: R30.2 SW1.3 U13.10([SPI_NSS] TIM2_CH3/(HS) PA3)
MODE3: R31.2 SW1.4 U13.6(OSCOUT/PA2)
ONEWIRE: D2.4 J1.2 U2.4(DQ)
POWER1: LED1.1(+) U15.2(1Y)
POWER2: LED2.1(+) U15.4(2Y)
POWER3: LED3.1(+) U15.6(3Y)
POWER4: LED4.1(+) U15.8(4Y)
POWER-1: R21.2 U5.4(EN#) U14.15(Q0)
POWER-2: R20.2 U7.4(EN#) U14.2(Q2)
POWER-3: R19.2 U9.4(EN#) U14.4(Q4)
POWER-4: R18.2 U11.4(EN#) U14.6(Q6)
VDS1: C9.1 C10.1 C11.1 D4.5 LED1.3(+) U5.1(VOUT) U15.1(1A) USB2.1(VCC)
VDS2: C14.1 C15.1 C16.1 D5.5 LED2.3(+) U7.1(VOUT) U15.3(2A) USB3.1(VCC)
VDS3: C19.1 C20.1 C21.1 D6.5 LED3.3(+) U9.1(VOUT) U15.5(3A) USB4.1(VCC)
VDS4: C24.1 C25.1 C26.1 D7.5 LED4.3(+) U11.1(VOUT) U15.9(4A) USB5.1(VCC)
VUSB: C7.2 D3.5 U4.6(VIN) USB1.A4B9(VBUS) USB1.B4A9(VBUS)
$1N390: U1.15(XOUT) X1.1(OSC1)
$1N404: C2.2 U1.14(VDD18)
$1N405: U1.16(XIN) X1.3(OSC2)
$1N406: C1.2 U1.13(VDD33)
$1N2303: R7.2 R8.2 R9.2 R10.2 R11.2 U4.5(ISET)
$2N997: R14.2 U5.5(ISET)
$2N2024: R15.2 U7.5(ISET)
$2N2374: R16.2 U9.5(ISET)
$2N2724: R17.2 U11.5(ISET)
$3N2300: C32.2 U13.8(VCAP)
$6N811: LED1.2(-) R29.2
$6N813: LED2.2(-) R28.2
$6N815: LED3.2(-) R27.2
$6N817: LED4.2(-) R26.2

Not connected (* = marked no-connect by the designer): D2 3*; J1 4* 5* 16* 17*; SW1 5* 6* 7* 8*; U2 1(NC)* 2(NC)* 6(NC)* 7(NC)* 8(NC)*; U3 4(NC)* 5(NC)*; U6 3(HSD2+)* 7(HSD2-)*; U8 3(HSD2+)* 7(HSD2-)*; U10 3(HSD2+)* 7(HSD2-)*; U12 3(HSD2+)* 7(HSD2-)*; U13 4(NRST)*; U14 9(Q7S)*; U15 10(5Y)* 12(6Y)*; USB1 1(SHELL)* A8(SBU1)* B8(SBU2)*

## Notes on the sheets
sheet 1
- USB Hub Switch
- 4 port USB 2.0 switch
- SL2.1A hub controller
- Switch power and data to downstream ports
- Bus 15P Connection
- USB Hub IC
- 3 operating modes set by switches
- Ganged Access: All ports on and off when Access signal goes high/low
- Discrete Access: Port 1 goes on when Access and GPIO1 high
- Independent: Port 1 goes on when GPIO1 high (Doesn't read access)
- Overcurrent outputs all assert the interrupt pin
- OneWire Temperature & EEPROM
- Input Pulldowns & ESD Protection
- Ideal Diode - to bus and internal control
- Input Current Limit (Always On)
- Upstream USB Port
- VIN to bus (via ideal diode) and ports
- If MCU detects higher USB-C current rating, it can increase the input current limit to 1.5A or 2.5A
sheet 2
- USB-A Ports
- Power Switching
- Data Switching
- Pull up power to default off
- Pull up data to default off
sheet 3
- Microcontroller
- SWIM debug pin is on bus IO 4
- I/O Expander
- Mode Select Switch
sheet 4
- Logic Inverter
- When the port is not on, show a red LED instead to indicate power
- RED: Device has power but this port is not on
- BLUE: This port is on and powered

# Board PCB 3.0.0
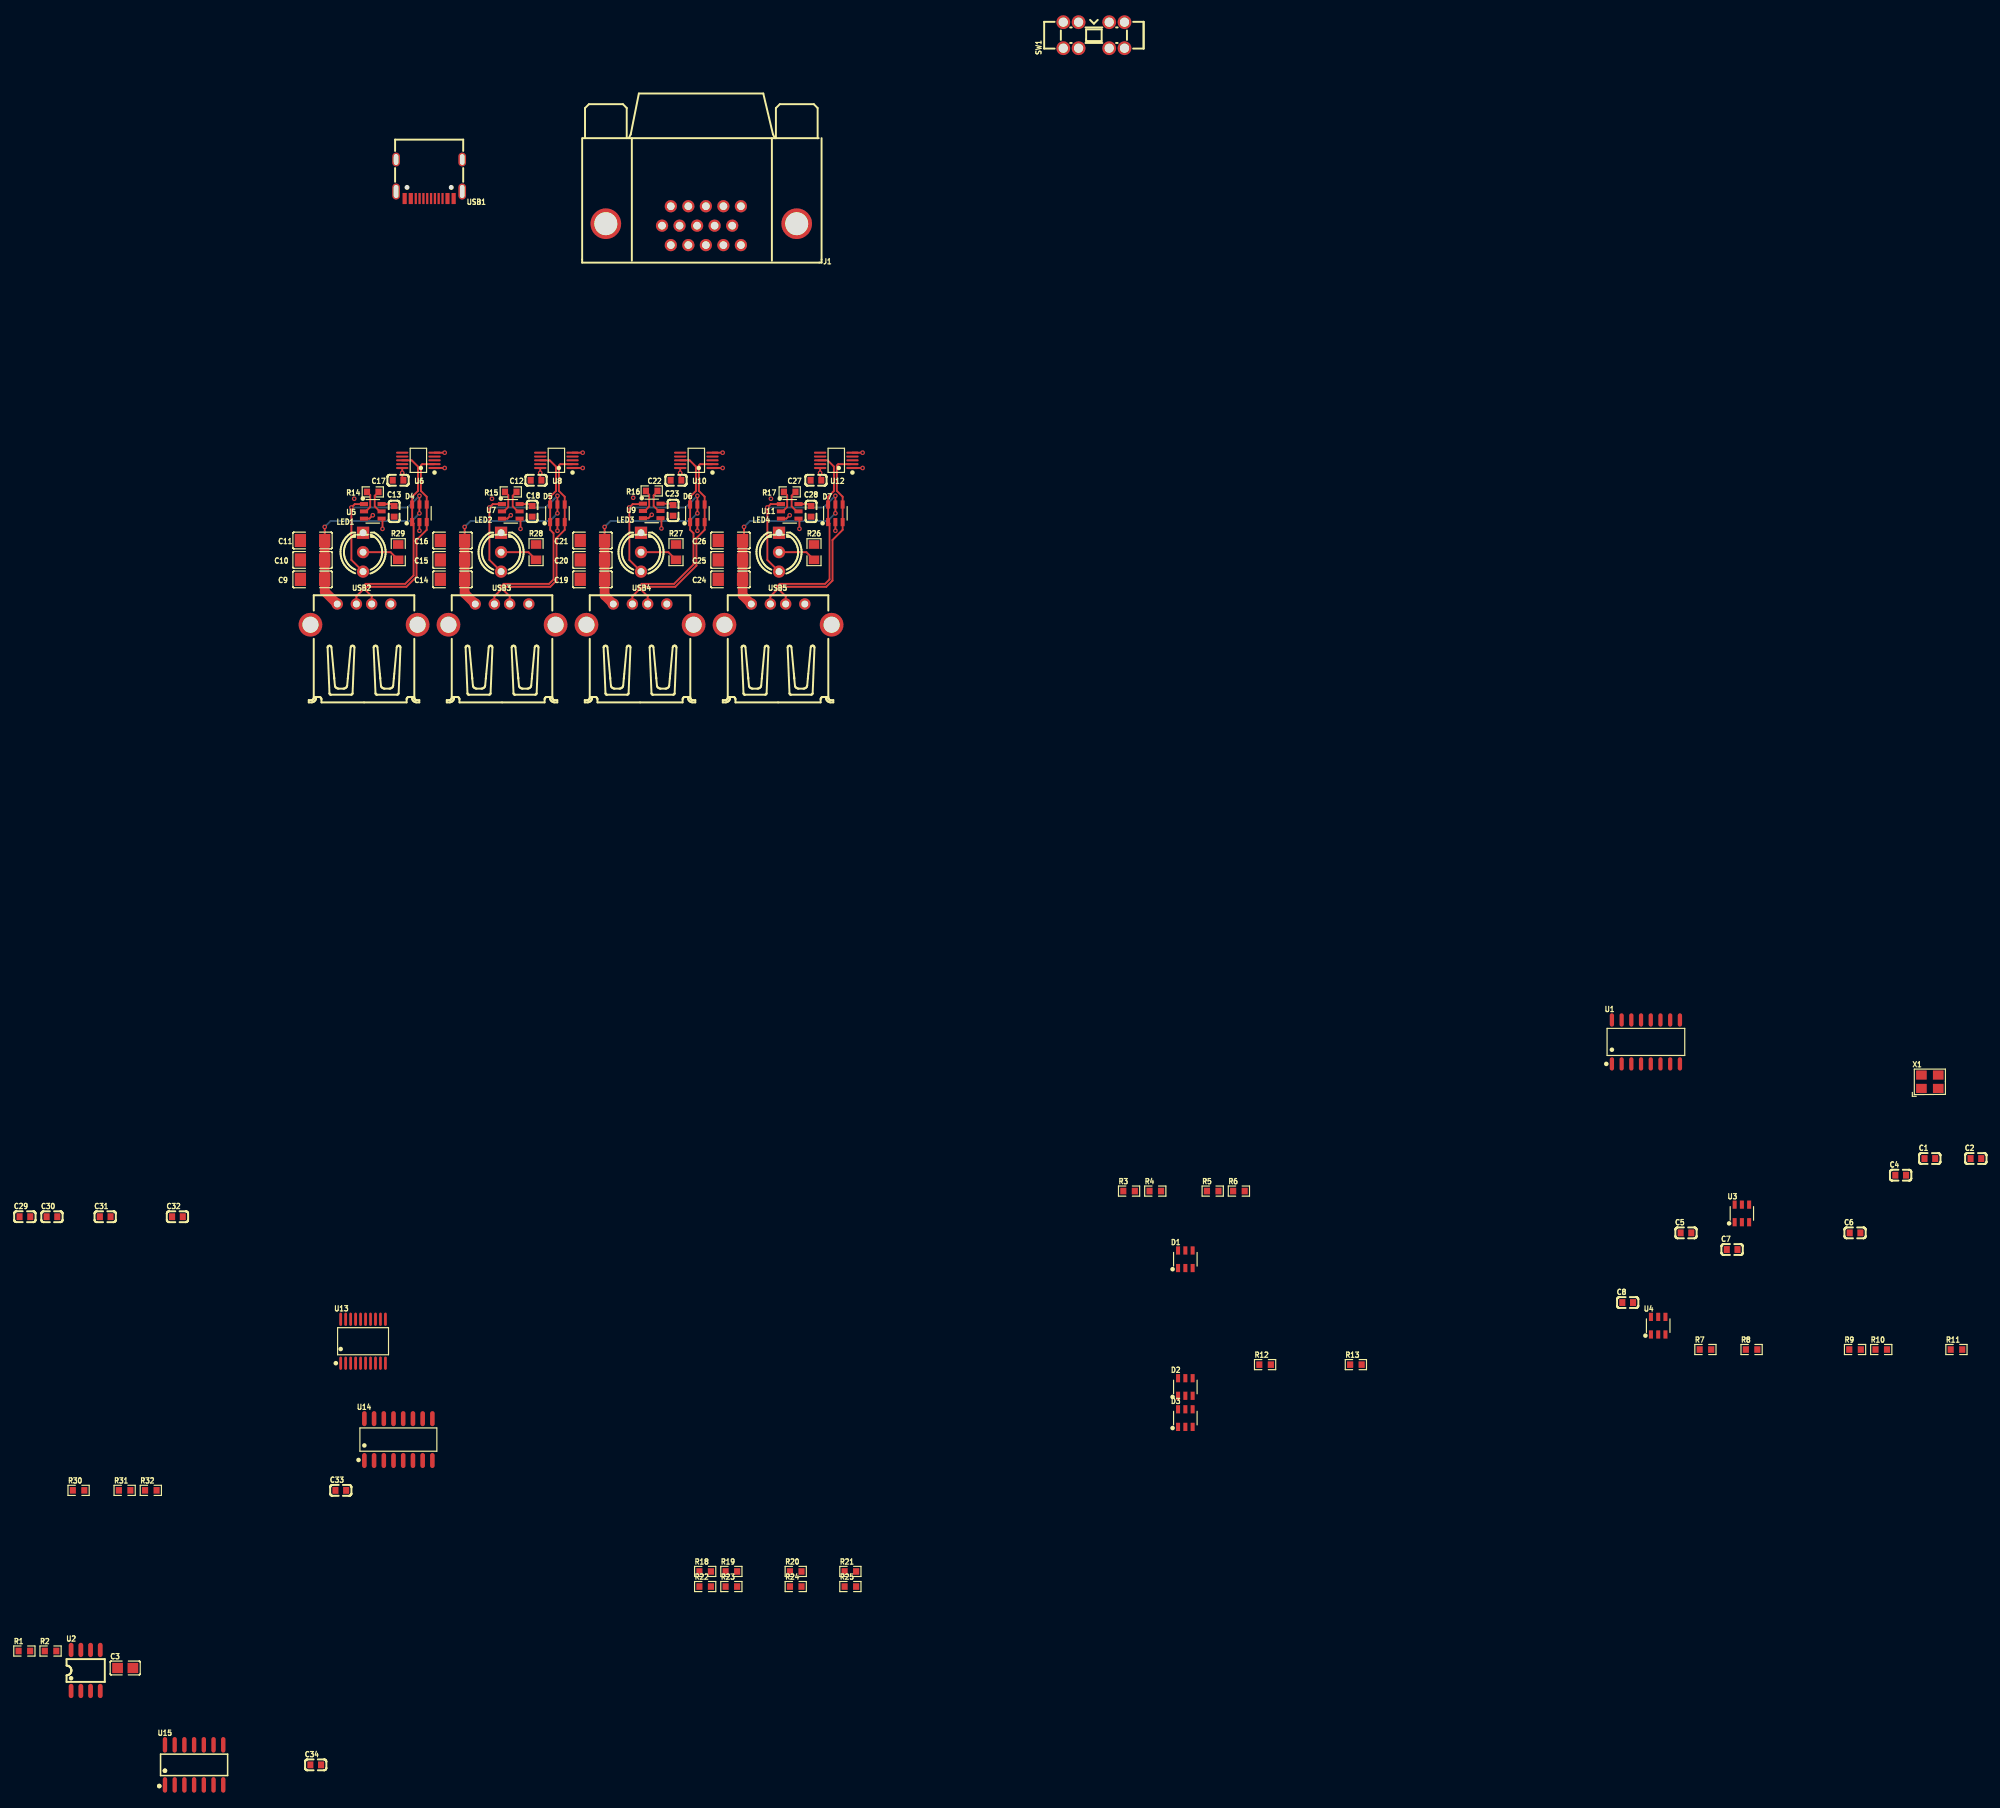
[diagram p4: board, top side]
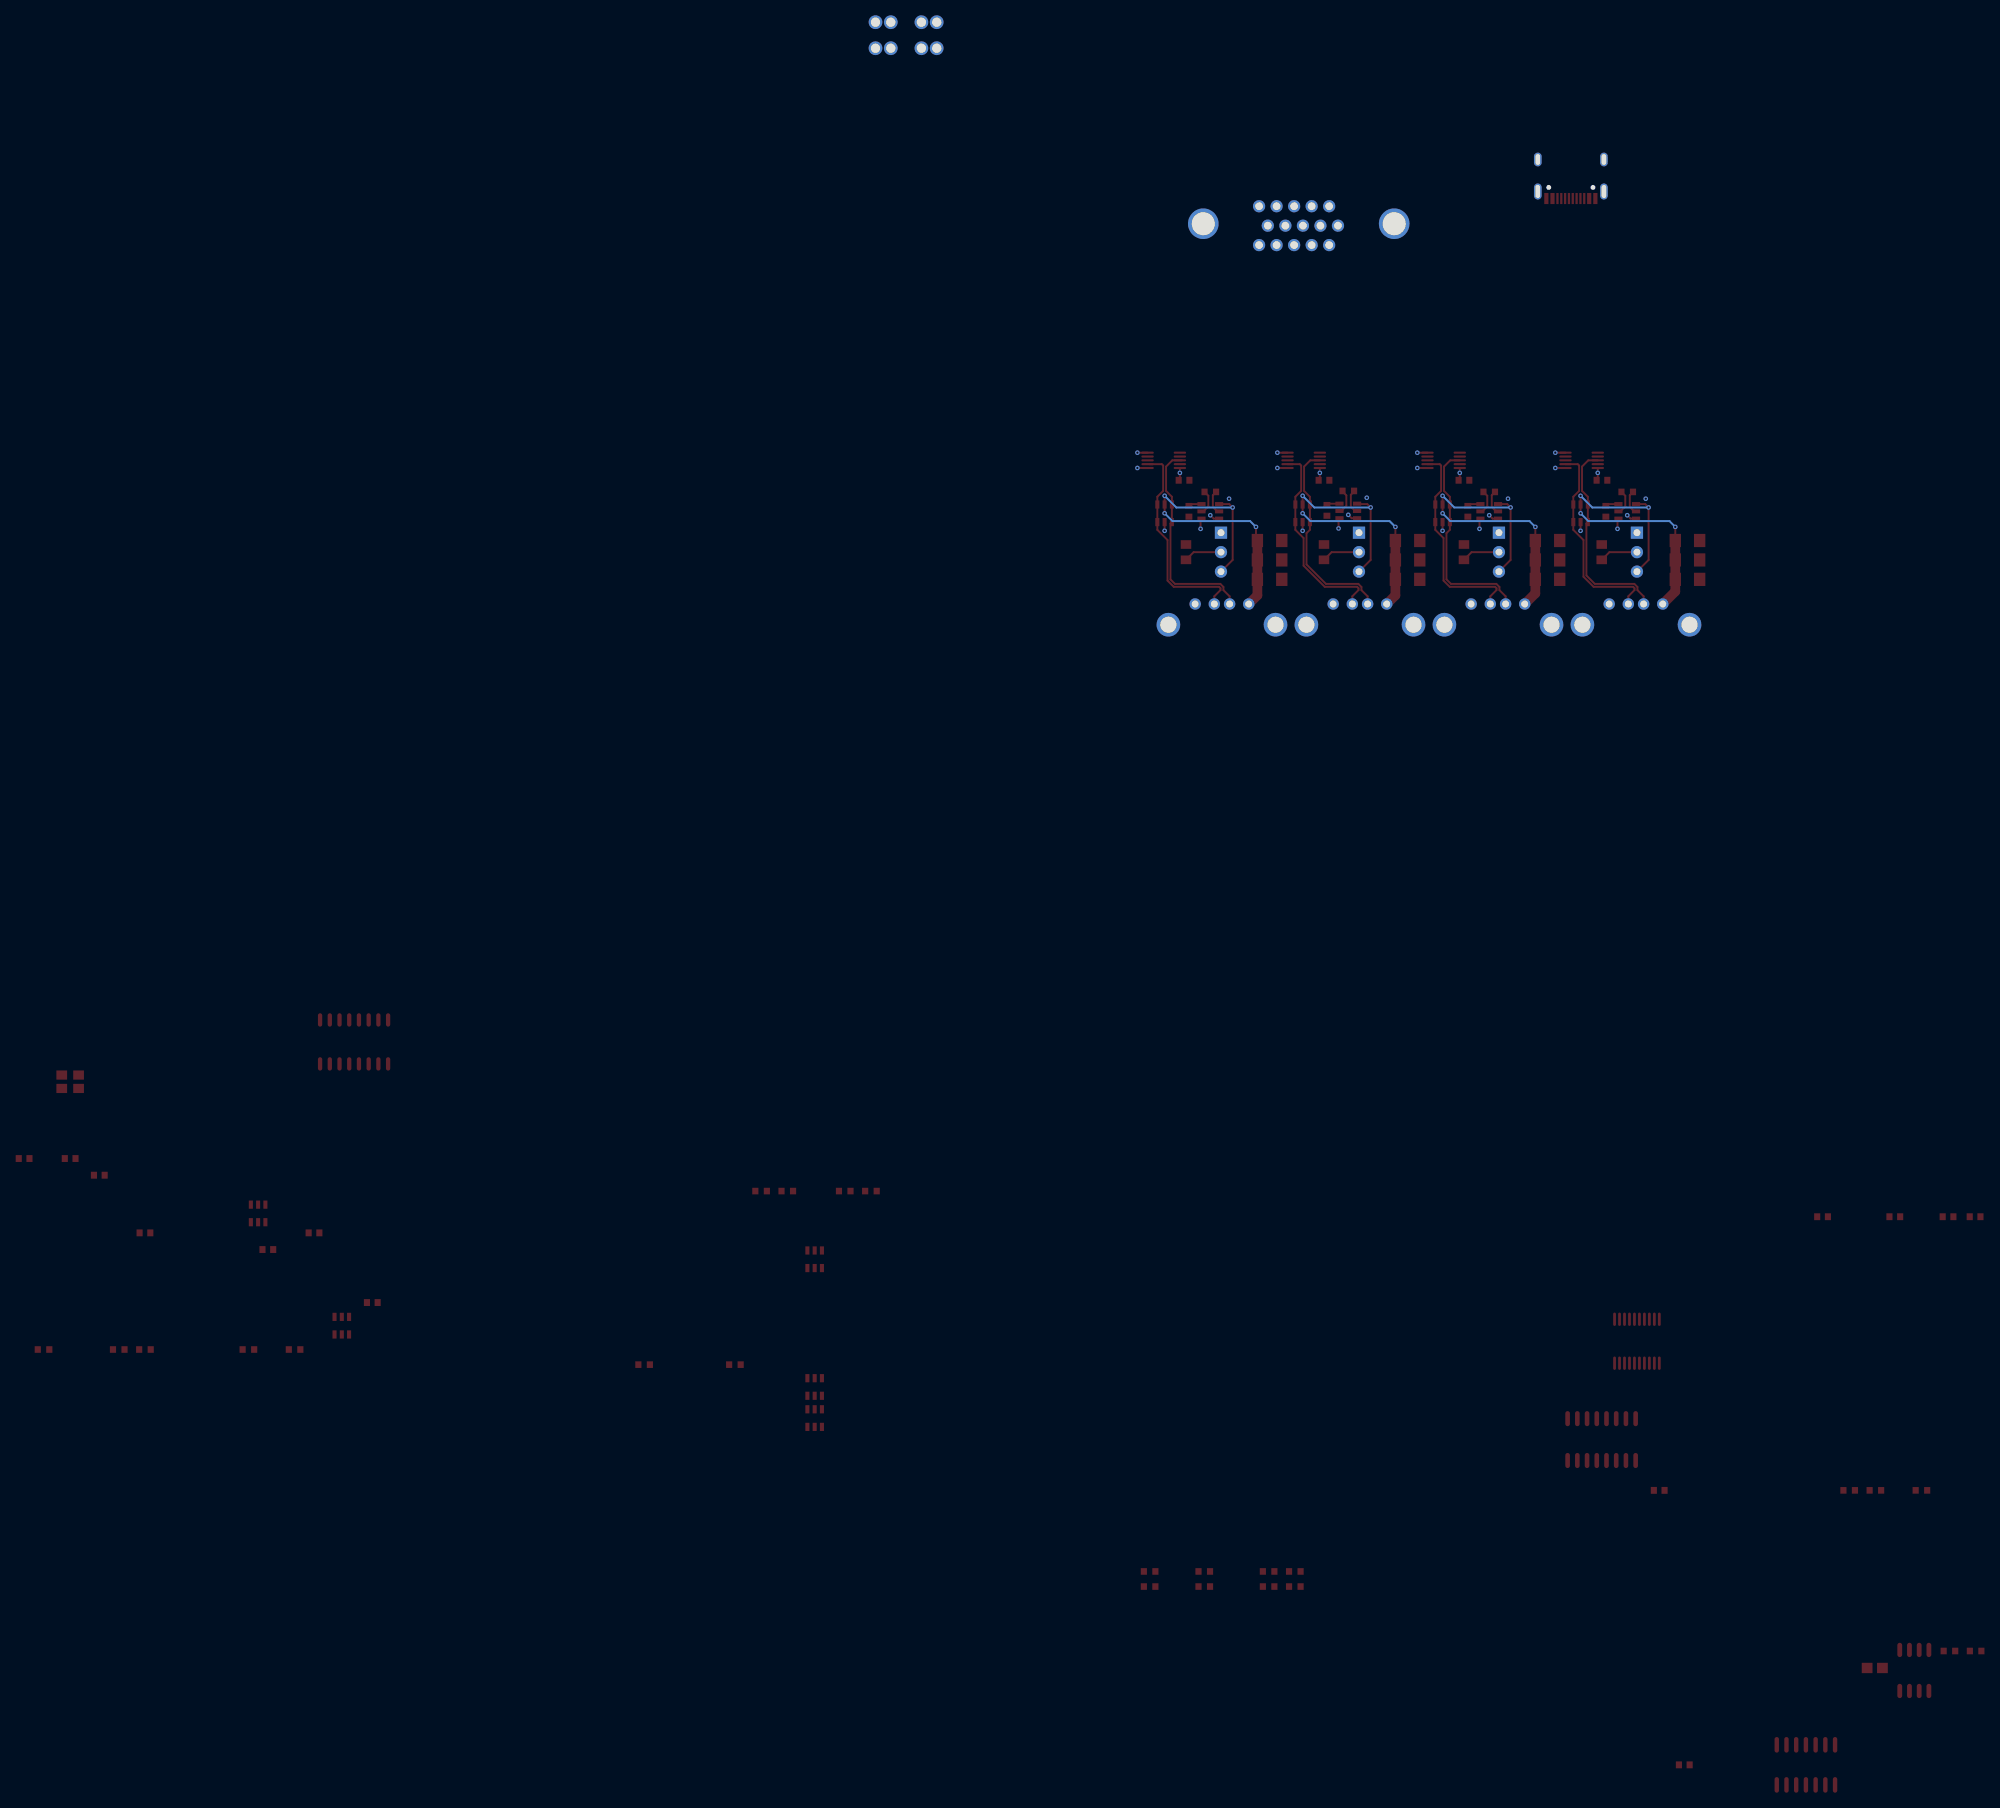
[diagram p5: board, bottom side, seen from below]

Outline 6.42 x 0.64 mm; copper layers: Top Layer, Bottom Layer. Coordinates in mm from the lower left corner of the outline.
Stack: Top Layer 0.035mm / Dielectric1 1.51mm FR4 er 4.5 / Bottom Layer 0.035mm

## Design rules (mm)
net D-: DP5
net D+: DP5
net D-1: DP1
net D+1: DP1
net D-2: DP2
net D+2: DP2
net D-3: DP3
net D+3: DP3
net D-4: DP4
net D+4: DP4
template: Custom Config
spacing copperThickness1oz (default): track to track 0.102, other pairs 0.152 to 0.3
spacing copperThickness2oz: track to track 0.203, other pairs 0.152 to 0.3
track width copperThickness1oz (default): min 0.127, default 0.254, max 2.54
track width copperThickness2oz: min 0.203, default 0.254, max 2.54
differential pair USB Coplanar (default): width min 0.203, default 0.203, max 0.203; gap min 0.127, default 0.127
via viaSize (default): diameter min 0.5, default 0.61, max 10; hole min 0.3, default 0.305, max 6.3

## Placement (name value [footprint] x y rotation side)
C1  10uF  [C0603]  199.32 -126.59 0 top
C2  10uF  [C0603]  205.34 -126.59 0 top
C3  100nF  [C0805]  -36.5 -193.17 0 top
C4  10uF  [C0603]  195.51 -128.77 0 top
C5  1uF  [C0603]  167.45 -136.31 0 top
C6  10uF  [C0603]  189.55 -136.31 0 top
C7  10uF  [C0603]  173.49 -138.49 0 top
C8  10uF  [C0603]  159.84 -145.42 0 top
C9  47uF  [C1206]  -12.03 -50.9 180 top
C10  47uF  [C1206]  -12.03 -48.36 180 top
C11  47uF  [C1206]  -12.03 -45.82 180 top
C12  100nF  [C0603]  17.18 -37.95 0 top
C13  10uF  [C0603]  -1.36 -42.01 90 top
C14  47uF  [C1206]  6.26 -50.9 180 top
C15  47uF  [C1206]  6.26 -48.36 180 top
C16  47uF  [C1206]  6.26 -45.82 180 top
C17  100nF  [C0603]  -0.85 -37.95 0 top
C18  10uF  [C0603]  16.67 -42.01 90 top
C19  47uF  [C1206]  24.55 -50.9 180 top
C20  47uF  [C1206]  24.55 -48.36 180 top
C21  47uF  [C1206]  24.55 -45.82 180 top
C22  100nF  [C0603]  35.47 -37.95 0 top
C23  10uF  [C0603]  35.09 -41.89 90 top
C24  47uF  [C1206]  42.58 -50.9 180 top
C25  47uF  [C1206]  42.58 -48.36 180 top
C26  47uF  [C1206]  42.58 -45.82 180 top
C27  100nF  [C0603]  53.76 -37.95 0 top
C28  10uF  [C0603]  53.12 -42.01 90 top
C29  10uF  [C0603]  -49.61 -134.2 0 top
C30  1uF  [C0603]  -46.08 -134.2 0 top
C31  100nF  [C0603]  -39.12 -134.2 0 top
C32  1uF  [C0603]  -29.68 -134.2 0 top
C33  100nF  [C0603]  -8.33 -169.96 0 top
C34  100nF  [C0603]  -11.61 -205.84 0 top
D1  SRV05-4  [SOT-23-6_L2.9-W1.6-P0.95-LS2.8-BL]  102.03 -139.76 0 top
D2  SRV05-4  [SOT-23-6_L2.9-W1.6-P0.95-LS2.8-BL]  102.03 -156.45 0 top
D3  SRV05-4  [SOT-23-6_L2.9-W1.6-P0.95-LS2.8-BL]  102.03 -160.52 0 top
D4  SRV05-4  [SOT-23-6_L2.9-W1.6-P0.95-LS2.8-BL]  1.94 -42.27 0 top
D5  SRV05-4  [SOT-23-6_L2.9-W1.6-P0.95-LS2.8-BL]  19.98 -42.27 0 top
D6  SRV05-4  [SOT-23-6_L2.9-W1.6-P0.95-LS2.8-BL]  38.26 -42.27 0 top
D7  SRV05-4  [SOT-23-6_L2.9-W1.6-P0.95-LS2.8-BL]  56.3 -42.27 0 top
J1  DS1038-15FBNSiA74-0CC  [DSUB-TH_DS1038-15FBNSIA74-0CC]  38.77 -4.67 180 top
LED1  TZ-LAMP05RB4HD-C  [LED-TH_3P-BD5.8-P2.54-R-BI]  -5.42 -47.35 90 top
LED2  TZ-LAMP05RB4HD-C  [LED-TH_3P-BD5.8-P2.54-R-BI]  12.61 -47.35 90 top
LED3  TZ-LAMP05RB4HD-C  [LED-TH_3P-BD5.8-P2.54-R-BI]  30.9 -47.35 90 top
LED4  TZ-LAMP05RB4HD-C  [LED-TH_3P-BD5.8-P2.54-R-BI]  48.93 -47.35 90 top
R1  10kΩ  [R0603]  -49.68 -190.96 0 top
R2  120kΩ  [R0603]  -46.26 -190.96 0 top
R3  10kΩ  [R0603]  94.68 -130.85 0 top
R4  10kΩ  [R0603]  98.1 -130.85 0 top
R5  10kΩ  [R0603]  105.61 -130.85 0 top
R6  10kΩ  [R0603]  109.03 -130.85 0 top
R7  120kΩ  [R0603]  169.99 -151.55 0 top
R8  120kΩ  [R0603]  176.03 -151.55 0 top
R9  120kΩ  [R0603]  189.55 -151.55 0 top
R10  120kΩ  [R0603]  192.97 -151.55 0 top
R11  120kΩ  [R0603]  202.8 -151.55 0 top
R12  5.1kΩ  [R0603]  112.45 -153.53 0 top
R13  5.1kΩ  [R0603]  124.32 -153.53 0 top
R14  120kΩ  [R0603]  -4.15 -39.47 0 top
R15  120kΩ  [R0603]  13.88 -39.47 0 top
R16  120kΩ  [R0603]  32.3 -39.35 0 top
R17  120kΩ  [R0603]  50.33 -39.47 0 top
R18  10kΩ  [R0603]  39.28 -180.56 0 top
R19  10kΩ  [R0603]  42.71 -180.56 0 top
R20  10kΩ  [R0603]  51.12 -180.56 0 top
R21  10kΩ  [R0603]  58.26 -180.56 0 top
R22  10kΩ  [R0603]  39.28 -182.53 0 top
R23  10kΩ  [R0603]  42.71 -182.53 0 top
R24  10kΩ  [R0603]  51.12 -182.53 0 top
R25  10kΩ  [R0603]  58.26 -182.53 0 top
R26  1kΩ  [R0805]  53.5 -47.35 270 top
R27  1kΩ  [R0805]  35.47 -47.35 270 top
R28  1kΩ  [R0805]  17.18 -47.35 270 top
R29  1kΩ  [R0805]  -0.82 -47.35 270 top
R30  10kΩ  [R0603]  -42.6 -169.96 0 top
R31  10kΩ  [R0603]  -36.58 -169.96 0 top
R32  10kΩ  [R0603]  -33.16 -169.96 0 top
SW1  K3-2336D-K1  [SW-TH_K3-2336D-K1]  90.08 20.22 90 top
U1  SL2.1A  [SOP-16_L10.0-W3.9-P1.27-LS6.0-BL]  162.22 -111.35 0 top
U2  DS18B20Z  [SOP-8_L4.9-W3.9-P1.27-LS6.0-BL]  -41.67 -193.5 0 top
U3  MX66100T  [SOT-23-6_L2.9-W1.6-P0.95-LS2.9-BL]  174.76 -133.77 0 top
U4  CH217K  [SOT-23-6_L2.9-W1.6-P0.95-LS2.8-BL]  163.82 -148.44 0 top
U5  CH217K  [SOT-23-6_L2.9-W1.6-P0.95-LS2.8-BL]  -4.15 -42.01 270 top
U6  DIO32220MP10  [MSOP-10_L3.0-W3.0-P0.50-LS5.0-BL]  1.8 -35.34 90 top
U7  CH217K  [SOT-23-6_L2.9-W1.6-P0.95-LS2.8-BL]  13.88 -42.01 270 top
U8  DIO32220MP10  [MSOP-10_L3.0-W3.0-P0.50-LS5.0-BL]  19.84 -35.34 90 top
U9  CH217K  [SOT-23-6_L2.9-W1.6-P0.95-LS2.8-BL]  32.3 -41.96 270 top
U10  DIO32220MP10  [MSOP-10_L3.0-W3.0-P0.50-LS5.0-BL]  38.13 -35.34 90 top
U11  CH217K  [SOT-23-6_L2.9-W1.6-P0.95-LS2.8-BL]  50.33 -42.01 270 top
U12  DIO32220MP10  [MSOP-10_L3.0-W3.0-P0.50-LS5.0-BL]  56.41 -35.34 90 top
U13  STM8S003F3P6TR  [TSSOP-20_L6.5-W4.4-P0.65-LS6.4-BL]  -5.42 -150.47 0 top
U14  74HC595D,118  [SOIC-16_L9.9-W3.9-P1.27-LS6.0-BL]  -0.81 -163.32 0 top
U15  74HC14D,653  [SOIC-14_L8.7-W3.9-P1.27-LS6.0-BL]  -27.5 -205.84 0 top
USB1  HYCW498-USBC16-735B  [USB-C-SMD_HYCW498-USBC16-735B]  3.21 1.42 180 top
USB2  902-131A1011D10100  [USB-A-TH__USB-AF-90]  -5.3 -55.47 0 top
USB3  902-131A1011D10100  [USB-A-TH__USB-AF-90]  12.74 -55.47 0 top
USB4  902-131A1011D10100  [USB-A-TH__USB-AF-90]  30.77 -55.47 0 top
USB5  902-131A1011D10100  [USB-A-TH__USB-AF-90]  48.81 -55.47 0 top
X1  12MHz  [OSC-SMD_4P-L3.2-W2.5-BL]  199.32 -116.56 0 top

## Footprints (pads in the part's own frame, mm; a bottom-side part is the same pattern mirrored in y, then rotated)
C0603
  rect 0.8x0.9 smd: 1(-0.7,0) 2(0.7,0)
C0805
  rect 1.41x1.35 smd: 1(-1,0) 2(1,0)
C1206
  rect 1.485x1.728 smd: 1(-1.593,0) 2(1.593,0)
DSUB-TH_DS1038-15FBNSIA74-0CC
  round 1.6 hole 1: 1(3.978,2.54) 2(1.688,2.54) 3(-0.603,2.54) 4(-2.893,2.54) 5(-5.182,2.54) 6(5.128,0) 7(2.837,0) 8(0.548,0) 9(-1.743,0) 10(-4.042,0) 11(3.978,-2.54) 12(1.688,-2.54) 13(-0.603,-2.54) 14(-2.893,-2.54) 15(-5.182,-2.54)
  round 4 hole 3: 16(12.473,-0.254) 17(-12.473,-0.254)
LED-TH_3P-BD5.8-P2.54-R-BI
  rect 1.6x1.6 hole 0.9: 1(2.54,0)
  round 1.6 hole 0.9: 2(0,0) 3(-2.54,0)
MSOP-10_L3.0-W3.0-P0.50-LS5.0-BL
  oval 0.28x1.62 smd: 1(-1,-2.11) 2(-0.5,-2.11) 3(0,-2.11) 4(0.5,-2.11) 5(1,-2.11) 6(1,2.11) 7(0.5,2.11) 8(0,2.11) 9(-0.5,2.11) 10(-1,2.11)
OSC-SMD_4P-L3.2-W2.5-BL
  rect 1.4x1.2 smd: 1(-1.1,-0.875) 2(1.1,-0.875) 3(1.1,0.875) 4(-1.1,0.875)
R0603
  rect 0.806x0.864 smd: 1(-0.753,0) 2(0.753,0)
R0805
  rect 1.133x1.377 smd: 1(-1,0) 2(1,0)
SOIC-14_L8.7-W3.9-P1.27-LS6.0-BL
  oval 0.574x2.038 smd: 1(-3.81,-2.619) 2(-2.54,-2.619) 3(-1.27,-2.619) 4(0,-2.619) 5(1.27,-2.619) 6(2.54,-2.619) 7(3.81,-2.619) 8(3.81,2.619) 9(2.54,2.619) 10(1.27,2.619) 11(0,2.619) 12(-1.27,2.619) 13(-2.54,2.619) 14(-3.81,2.619)
SOIC-16_L9.9-W3.9-P1.27-LS6.0-BL
  oval 0.602x1.971 smd: 1(-4.445,-2.736) 2(-3.175,-2.736) 3(-1.905,-2.736) 4(-0.635,-2.736) 5(0.635,-2.736) 6(1.905,-2.736) 7(3.175,-2.736) 8(4.445,-2.736) 9(4.445,2.736) 10(3.175,2.736) 11(1.905,2.736) 12(0.635,2.736) 13(-0.635,2.736) 14(-1.905,2.736) 15(-3.175,2.736) 16(-4.445,2.736)
SOP-8_L4.9-W3.9-P1.27-LS6.0-BL
  oval 0.63x1.865 smd: 1(-1.905,-2.683) 2(-0.635,-2.683) 3(0.635,-2.683) 4(1.905,-2.683) 5(1.905,2.683) 6(0.635,2.683) 7(-0.635,2.683) 8(-1.905,2.683)
SOP-16_L10.0-W3.9-P1.27-LS6.0-BL
  oval 0.56x1.745 smd: 1(-4.445,-2.873) 2(-3.175,-2.873) 3(-1.905,-2.873) 4(-0.635,-2.873) 5(0.635,-2.873) 6(1.905,-2.873) 7(3.175,-2.873) 8(4.445,-2.873) 9(4.445,2.873) 10(3.175,2.873) 11(1.905,2.873) 12(0.635,2.873) 13(-0.635,2.873) 14(-1.905,2.873) 15(-3.175,2.873) 16(-4.445,2.873)
SOT-23-6_L2.9-W1.6-P0.95-LS2.8-BL
  rect 0.532x1.072 smd: 1(-0.95,-1.149) 2(0,-1.149) 3(0.95,-1.149) 4(0.95,1.149) 5(0,1.149) 6(-0.95,1.149)
SOT-23-6_L2.9-W1.6-P0.95-LS2.9-BL
  rect 0.532x1.072 smd: 1(-0.95,-1.149) 2(0,-1.149) 3(0.95,-1.149) 4(0.95,1.149) 5(0,1.149) 6(-0.95,1.149)
SW-TH_K3-2336D-K1
  round 1.8 hole 1.2: 1(-1.7,4) 2(-1.7,2) 3(-1.7,-2) 4(-1.7,-4) 5(1.7,-4) 6(1.7,-2) 7(1.7,2) 8(1.7,4)
TSSOP-20_L6.5-W4.4-P0.65-LS6.4-BL
  oval 0.364x1.742 smd: 1(-2.925,-2.871) 2(-2.275,-2.871) 3(-1.625,-2.871) 4(-0.975,-2.871) 5(-0.325,-2.871) 6(0.325,-2.871) 7(0.975,-2.871) 8(1.625,-2.871) 9(2.275,-2.871) 10(2.925,-2.871) 11(2.925,2.871) 12(2.275,2.871) 13(1.625,2.871) 14(0.975,2.871) 15(0.325,2.871) 16(-0.325,2.871) 17(-0.975,2.871) 18(-1.625,2.871) 19(-2.275,2.871) 20(-2.925,2.871)
USB-A-TH__USB-AF-90
  round 1.5 hole 0.9: 1(-3.5,1.355) 2(-1,1.355) 3(1,1.355) 4(3.5,1.355)
  round 3.1 hole 2.1: SH1(7,-1.355) SH2(-7,-1.355)
USB-C-SMD_HYCW498-USBC16-735B
  oval 1x2.1 hole 0.6x1.7: 1(-4.32,1.63) 2(4.32,1.63)
  oval 1x1.8 hole 0.6x1.4: 3(-4.32,-2.55) 4(4.32,-2.55)
  rect 0.55x1.45 smd: A1B12(-3.2,2.55) A4B9(-2.4,2.55) B1A12(3.2,2.55) B4A9(2.4,2.55)
  rect 0.3x1.45 smd: A5(-1.25,2.55) A6(-0.25,2.55) A7(0.25,2.55) A8(1.25,2.55) B5(1.75,2.55) B6(0.75,2.55) B7(-0.75,2.55) B8(-1.75,2.55)

## Nets
As in the schematic.

Pads without a net: D2 3; J1 4 5 16 17; SW1 5 6 7 8; U2 1 2 6 7 8; U3 4 5; U6 3 7; U8 3 7; U10 3 7; U12 3 7; U13 4; U14 9; U15 10 12; USB1 1 2 3 4 A8 B8

## Via types
v1: diameter 0.61, hole 0.305, Top Layer to Bottom Layer, 44 vias

## Routing (per net, layer and track width the routed paths; a pad name or vN(x,y) marks a point on that pad's centre or on a via; arc(x,y) is an arc through that point)
+5V: length 6
  Top Layer w0.254: 36.02,-37.79 v1(36.02,-36.99) U10.10 ; U6.10 v1(-0.31,-36.99) -0.31,-37.79 C17.2 ; U8.10 v1(17.73,-36.99) 17.73,-37.79 ; U12.10 v1(54.3,-36.99) 54.3,-37.79
GND: length 27.5
  Top Layer w0.254: U6.1 v1(5.24,-36.34) ; D7.2 v1(56.3,-44.55) ; U10.1 v1(41.57,-36.34) ; U5.2 -5.06,-42.01 -4.49,-41.44 -4.49,-39.9 -4.92,-39.47 -5.16,-39.47 ; 49.57,-39.47 50,-39.9 50,-41.44 49.43,-42.01 ; D4.2 v1(1.94,-44.55) ; U12.5 v1(59.85,-34.34) ; 31.4,-41.96 31.96,-41.39 31.96,-39.85 31.54,-39.42 ; 13.12,-39.47 13.55,-39.9 13.55,-41.44 12.98,-42.01 ; U12.1 v1(59.85,-36.34) ; U6.5 v1(5.24,-34.34) ; D5.2 v1(19.98,-44.55) ; U8.1 v1(23.28,-36.34) ; D6.2 v1(38.26,-44.55) ; U10.5 v1(41.57,-34.34) ; U8.5 v1(23.28,-34.34)
  vias: v1(-6.58,-40.36) v1(11.43,-40.36) v1(29.88,-40.23) v1(47.87,-40.36)
VIN: length 7
  Top Layer w0.254: C23.2 34.91,-41.01 U9.6 ; C18.2 16.42,-41.06 U7.6 ; U11.6 52.87,-41.06 C28.2 ; C13.2 -1.61,-41.06 U5.6
D+1: length 26.9
  Top Layer w0.254: -4.3,-54.12 -4.3,-53.12 -5.11,-52.31 -5.11,-52.05 -4.93,-51.87 0.24,-51.87 1.56,-50.55 1.56,-45.76 2.89,-44.43 D4.3 D4.4 2.89,-40.1 2.13,-39.34 2.13,-36.02 2.31,-35.84 U6.2
D+2: length 27.4
  Top Layer w0.254: 13.74,-54.12 13.74,-53.12 12.93,-52.31 12.93,-52.05 13.11,-51.87 19.04,-51.87 19.85,-51.06 19.85,-45.51 20.93,-44.43 D5.3 D5.4 20.93,-40.1 20.17,-39.34 20.17,-36.02 20.35,-35.84 U8.2
D+3: length 26.5
  Top Layer w0.254: 31.77,-54.12 31.77,-53.12 30.96,-52.31 30.96,-52.05 31.14,-51.87 35.37,-51.87 38.14,-49.11 38.14,-45.51 39.21,-44.43 D6.3 D6.4 39.21,-40.1 38.45,-39.34 38.45,-36.02 38.63,-35.84 U10.2
D+4: length 27.5
  Top Layer w0.254: 49.81,-54.12 49.81,-53.12 49,-52.31 49,-52.05 49.18,-51.87 55.11,-51.87 55.92,-51.06 55.92,-45.76 57.25,-44.43 D7.3 D7.4 57.25,-40.1 56.49,-39.34 56.49,-36.02 56.67,-35.84 58.27,-35.84
D-1: length 26.9
  Top Layer w0.254: -6.3,-54.12 -6.3,-53.12 -5.49,-52.31 -5.49,-51.89 -5.08,-51.49 0.08,-51.49 1.18,-50.39 1.18,-43.6 D4.1 D4.6 0.99,-40.1 1.75,-39.34 1.75,-36.16 0.93,-35.34 U6.8
D-2: length 27.5
  Top Layer w0.254: U8.8 18.97,-35.34 19.79,-36.16 19.79,-39.34 19.03,-40.1 D5.6 D5.1 19.03,-44.43 19.47,-44.87 19.47,-50.9 18.88,-51.49 12.95,-51.49 12.55,-51.89 12.55,-52.31 11.74,-53.12 11.74,-54.12
D-3: length 26.6
  Top Layer w0.254: U10.8 37.26,-35.34 38.07,-36.16 38.07,-39.34 37.31,-40.1 D6.6 D6.1 37.31,-44.43 37.76,-44.87 37.76,-48.95 35.22,-51.49 30.98,-51.49 30.58,-51.89 30.58,-52.31 29.77,-53.12 29.77,-54.12
D-4: length 27.4
  Top Layer w0.254: 54.05,-35.34 55.29,-35.34 56.11,-36.16 56.11,-39.34 55.35,-40.1 D7.6 D7.1 55.54,-43.6 55.54,-50.9 54.95,-51.49 49.02,-51.49 48.61,-51.89 48.61,-52.31 47.81,-53.12 47.81,-54.12
INTERRUPT: length 5.3
  Top Layer w0.254: U9.3 31.86,-42.91 v1(32.3,-42.47) ; v1(50.33,-42.52) 49.89,-42.96 U11.3 ; v1(13.88,-42.52) 13.44,-42.96 U7.3 ; U5.3 -4.6,-42.96 v1(-4.15,-42.52)
POWER-1: length 1.4
  Top Layer w0.254: U5.4 -2.88,-43.08 v1(-2.88,-44.3)
POWER-2: length 1.4
  Top Layer w0.254: U7.4 15.15,-43.08 v1(15.15,-44.3)
POWER-3: length 1.4
  Top Layer w0.254: v1(33.57,-44.25) 33.57,-43.03 U9.4
POWER-4: length 1.4
  Top Layer w0.254: v1(51.6,-44.3) 51.6,-43.08 U11.4
VDS1: length 47.1
  Top Layer w0.254: LED1.3 -6.95,-48.36 v1(-6.95,-41.5) -6.51,-41.06 U5.1 ; C9.1 -11.01,-50.9 ; C11.1 v1(-10.44,-44.04) ; v1(1.94,-39.98) D4.5 v1(1.94,-42.27)
  Top Layer w1.27: C11.1 C10.1 C9.1 -10.44,-52.48 -8.8,-54.12
  Bottom Layer w0.254: v1(-10.44,-44.04) -9.67,-43.28 0.93,-43.28 v1(1.94,-42.27) ; v1(-6.95,-41.5) 0.42,-41.5 v1(1.94,-39.98)
VDS2: length 46.2
  Top Layer w0.254: C16.1 v1(7.85,-44.04) ; v1(19.98,-42.27) D5.5 v1(19.98,-39.98) ; LED2.3 11.09,-48.36 v1(11.09,-41.5) 11.53,-41.06 U7.1
  Top Layer w1.27: 9.24,-54.12 7.85,-52.73 C14.1 C15.1 C16.1
  Bottom Layer w0.254: v1(11.09,-41.5) 18.45,-41.5 v1(19.98,-39.98) ; v1(7.85,-44.04) 8.61,-43.28 18.96,-43.28 v1(19.98,-42.27)
VDS3: length 46.1
  Top Layer w0.254: 31.02,-41.06 29.82,-41.06 v1(29.37,-41.5) 29.37,-48.36 LED3.3 ; v1(38.26,-42.27) D6.5 v1(38.26,-39.98) ; C21.1 v1(26.14,-44.04)
  Top Layer w1.27: 27.27,-54.12 26.14,-52.99 C19.1 C20.1 C21.1
  Bottom Layer w0.254: v1(26.14,-44.04) 26.9,-43.28 37.25,-43.28 v1(38.26,-42.27) ; v1(38.26,-39.98) 36.74,-41.5 v1(29.37,-41.5)
VDS4: length 45.9
  Top Layer w0.254: v1(44.36,-44.04) 44.36,-45.64 C26.1 ; LED4.3 47.41,-48.36 v1(47.41,-41.5) 47.85,-41.06 49.05,-41.06 ; v1(56.3,-39.98) D7.5 v1(56.3,-42.27)
  Top Layer w1.27: C26.1 C25.1 C24.1 44.17,-52.99 45.31,-54.12
  Bottom Layer w0.254: v1(47.41,-41.5) 54.77,-41.5 v1(56.3,-39.98) ; v1(56.3,-42.27) 55.28,-43.28 45.12,-43.28 v1(44.36,-44.04)
$2N997: length 3.3
  Top Layer w0.254: U5.5 -3.25,-42.01 -3.9,-41.36 -3.9,-39.97 R14.2
$2N2024: length 3.3
  Top Layer w0.254: U7.5 14.78,-42.01 14.13,-41.36 14.13,-39.97 R15.2
$2N2374: length 3
  Top Layer w0.254: 33.05,-39.42 32.55,-39.92 32.55,-41.31 33.2,-41.96
$2N2724: length 3
  Top Layer w0.254: R17.2 50.58,-39.97 50.58,-41.36 51.23,-42.01
$6N811: length 5
  Top Layer w0.254: LED1.2 -1.83,-47.35 R29.2
$6N813: length 5
  Top Layer w0.254: R28.2 16.18,-47.35 LED2.2
$6N815: length 5
  Top Layer w0.254: R27.2 34.47,-47.35 LED3.2
$6N817: length 5
  Top Layer w0.254: R26.2 52.5,-47.35 LED4.2
